# EAGLE design micromouse_board_revB_V0.0.12 (EAGLE 9.4.2)
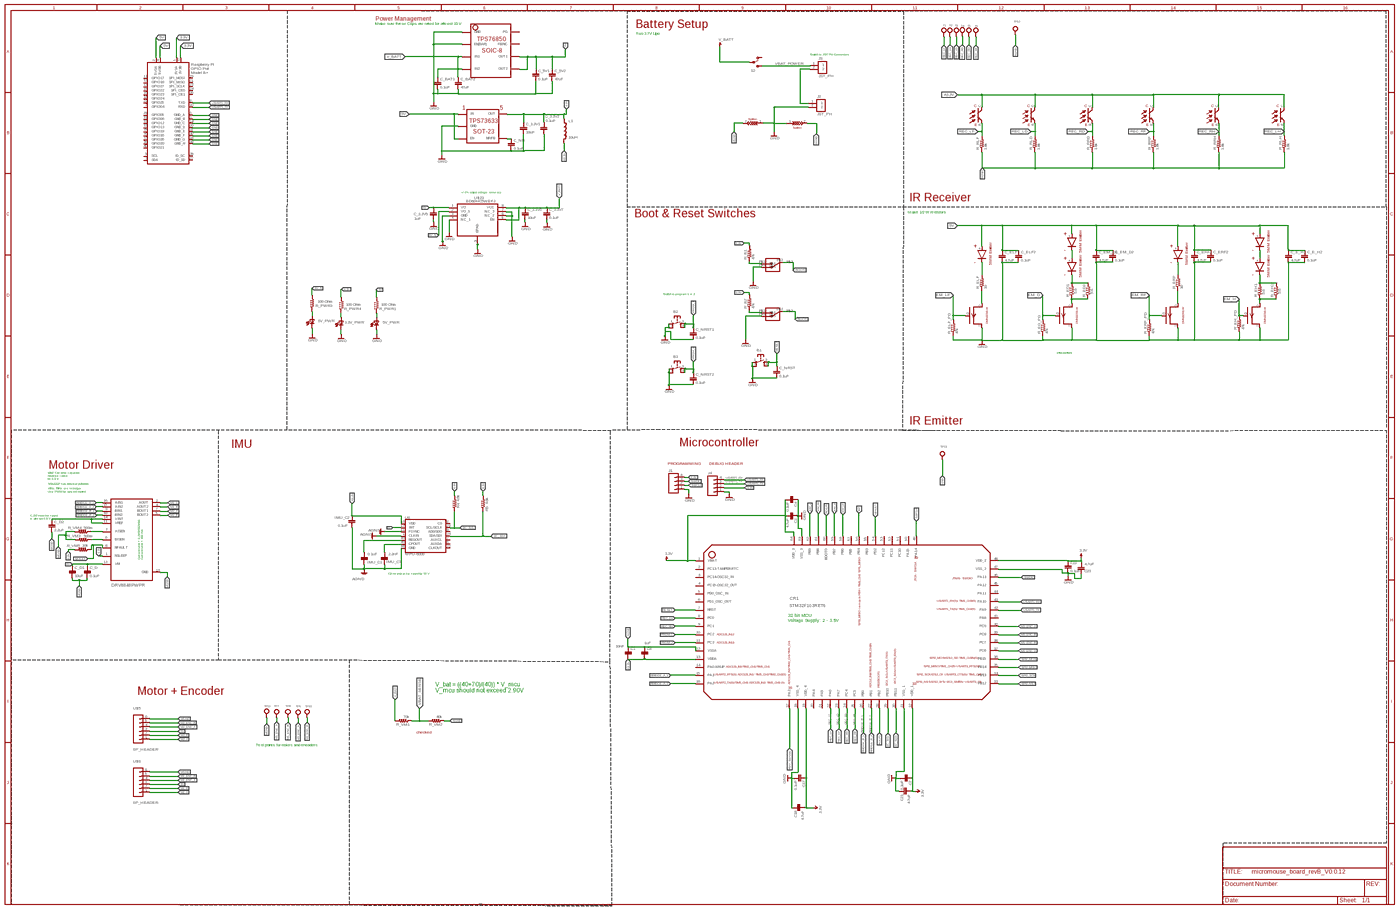
[diagram p0: schematic, sheet 1, overview]
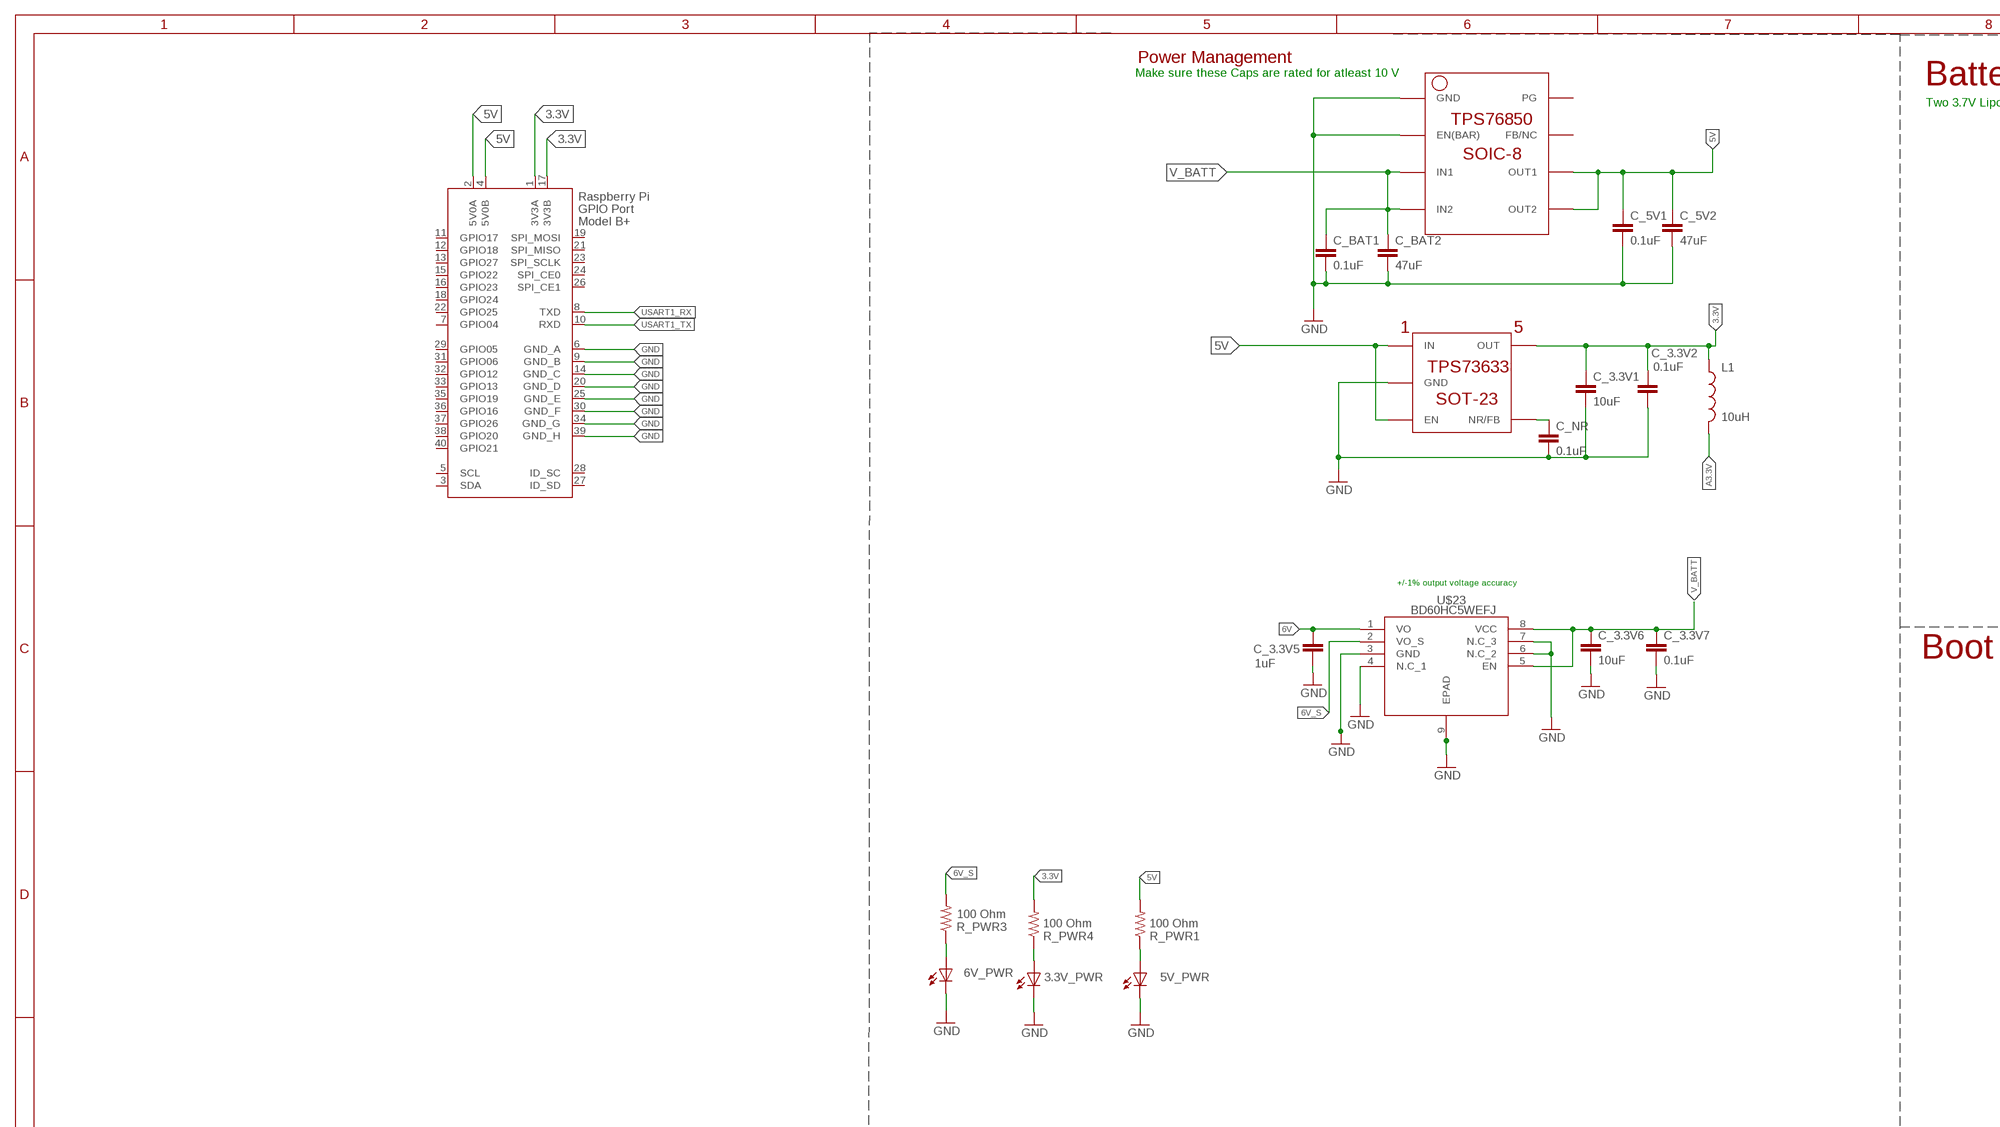
[diagram p1: schematic, sheet 1, part 1 of 4]
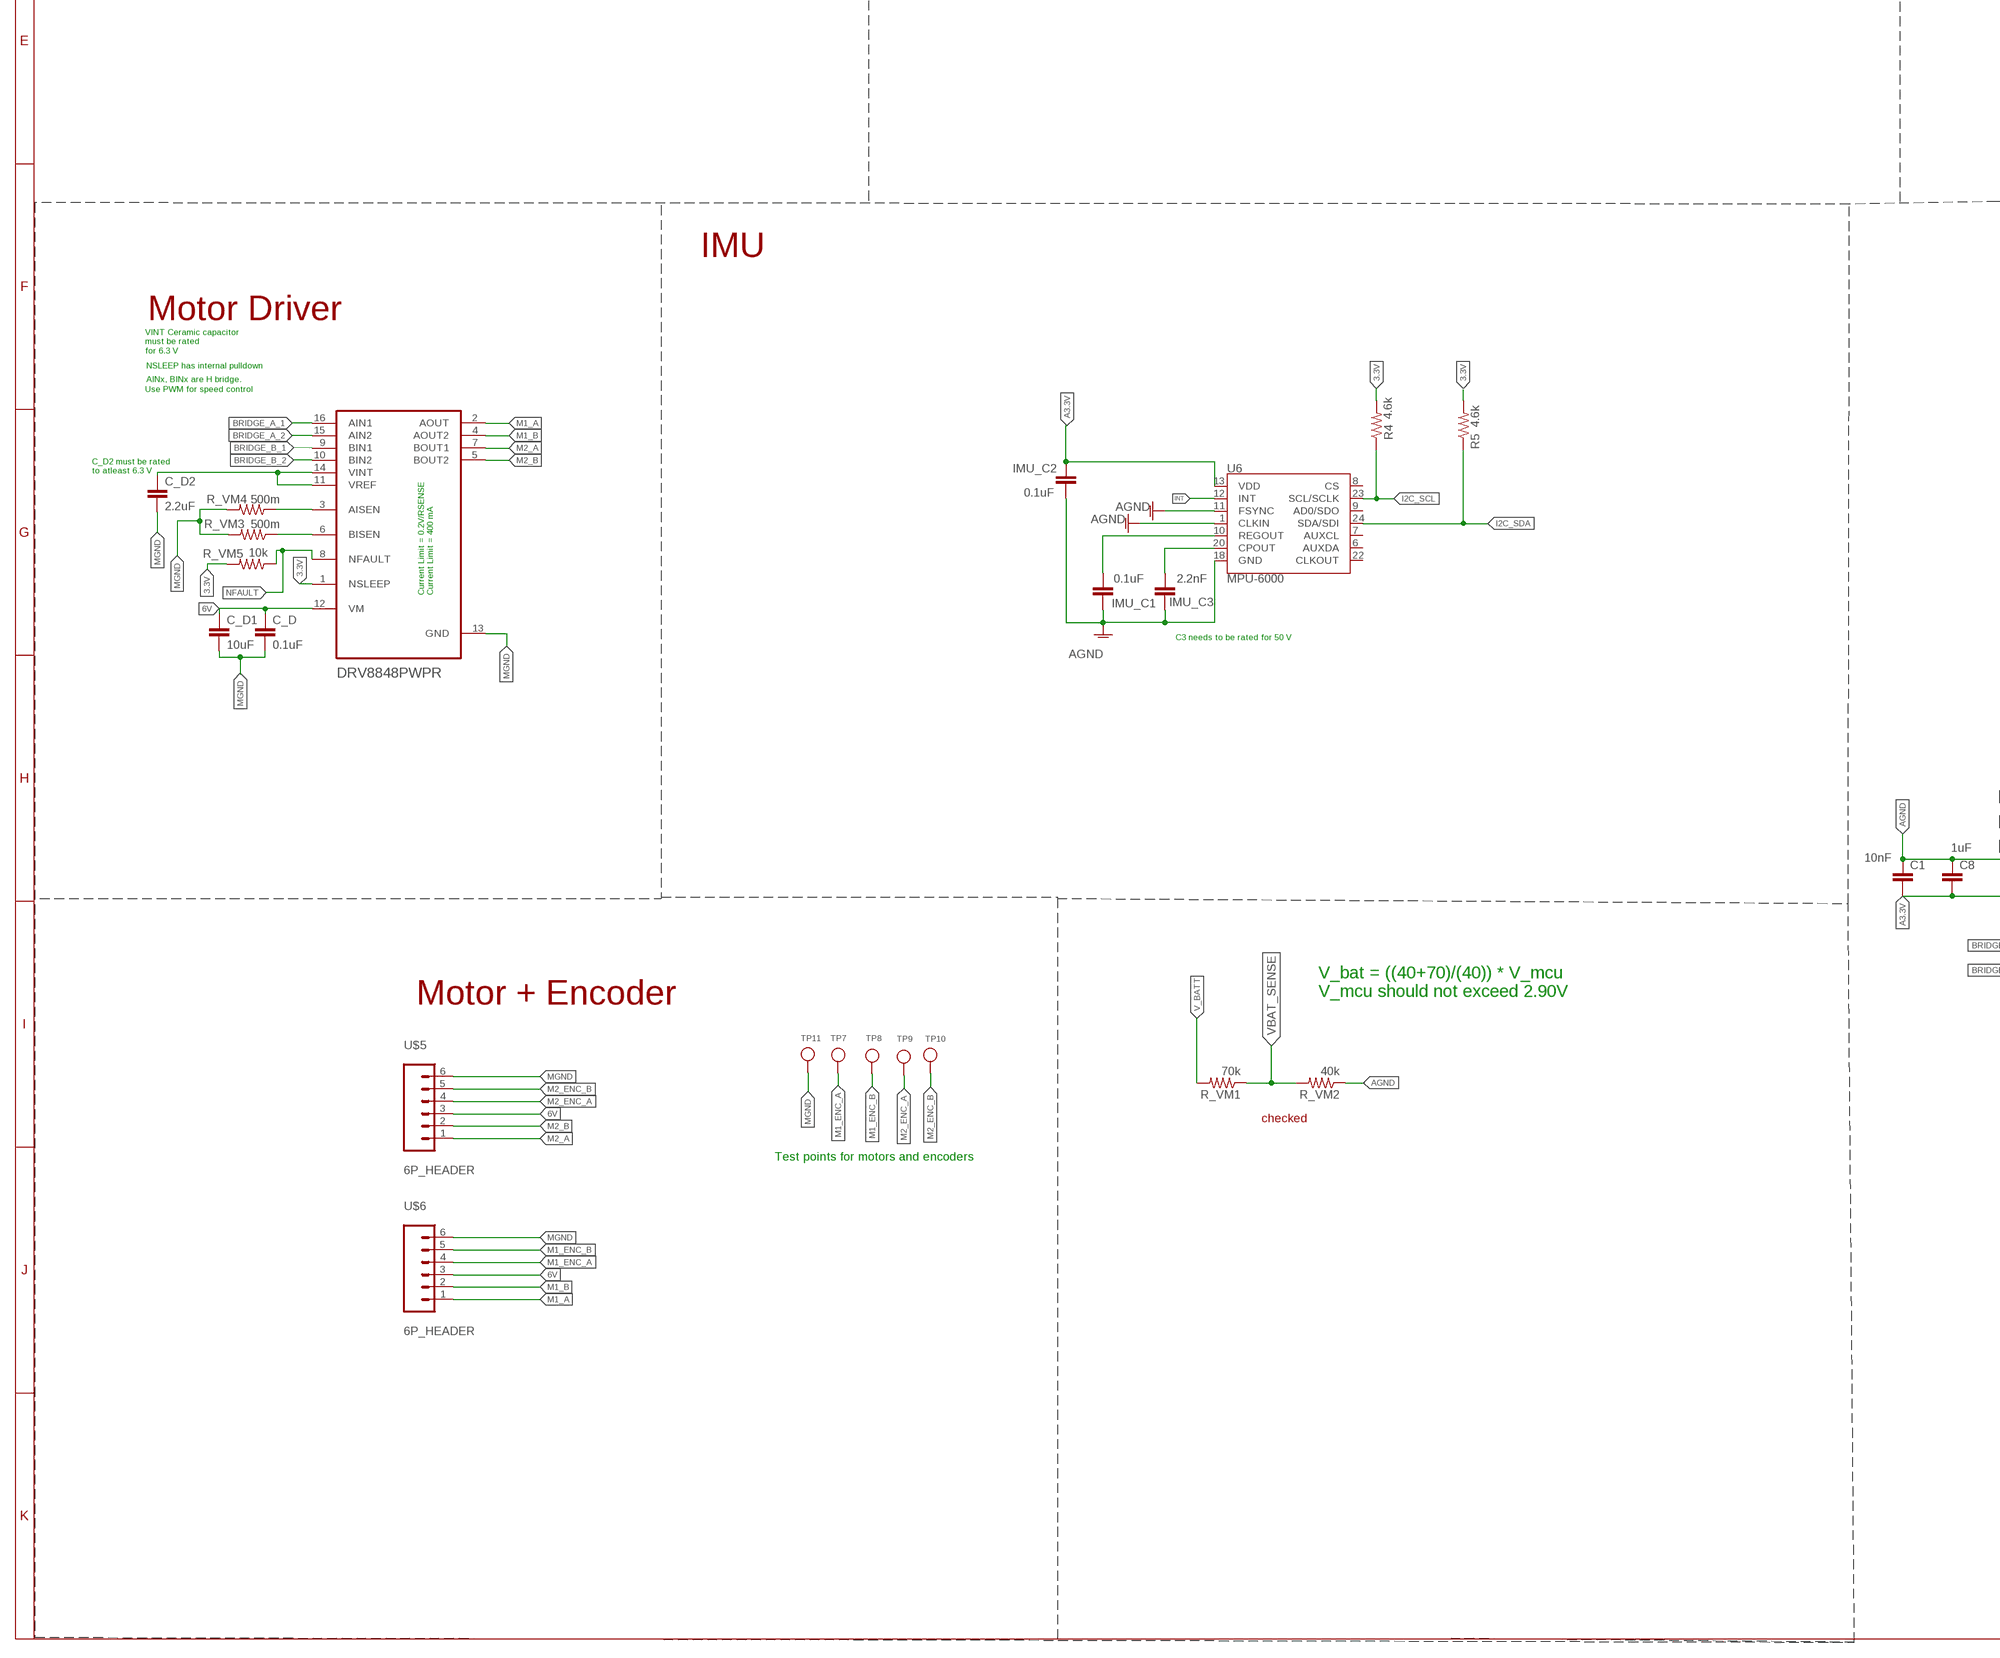
[diagram p2: schematic, sheet 1, part 2 of 4]
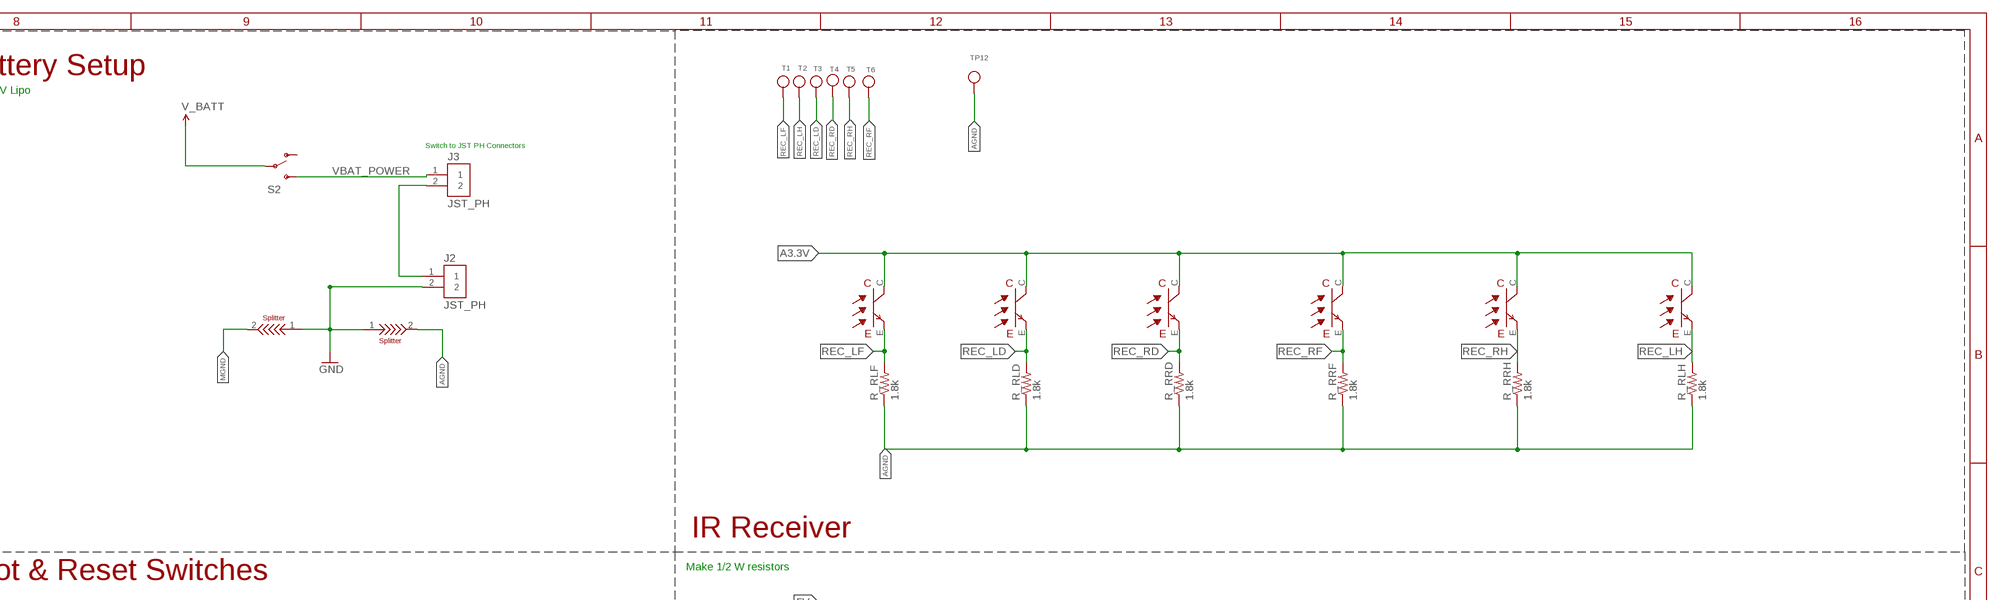
[diagram p3: schematic, sheet 1, part 3 of 4]
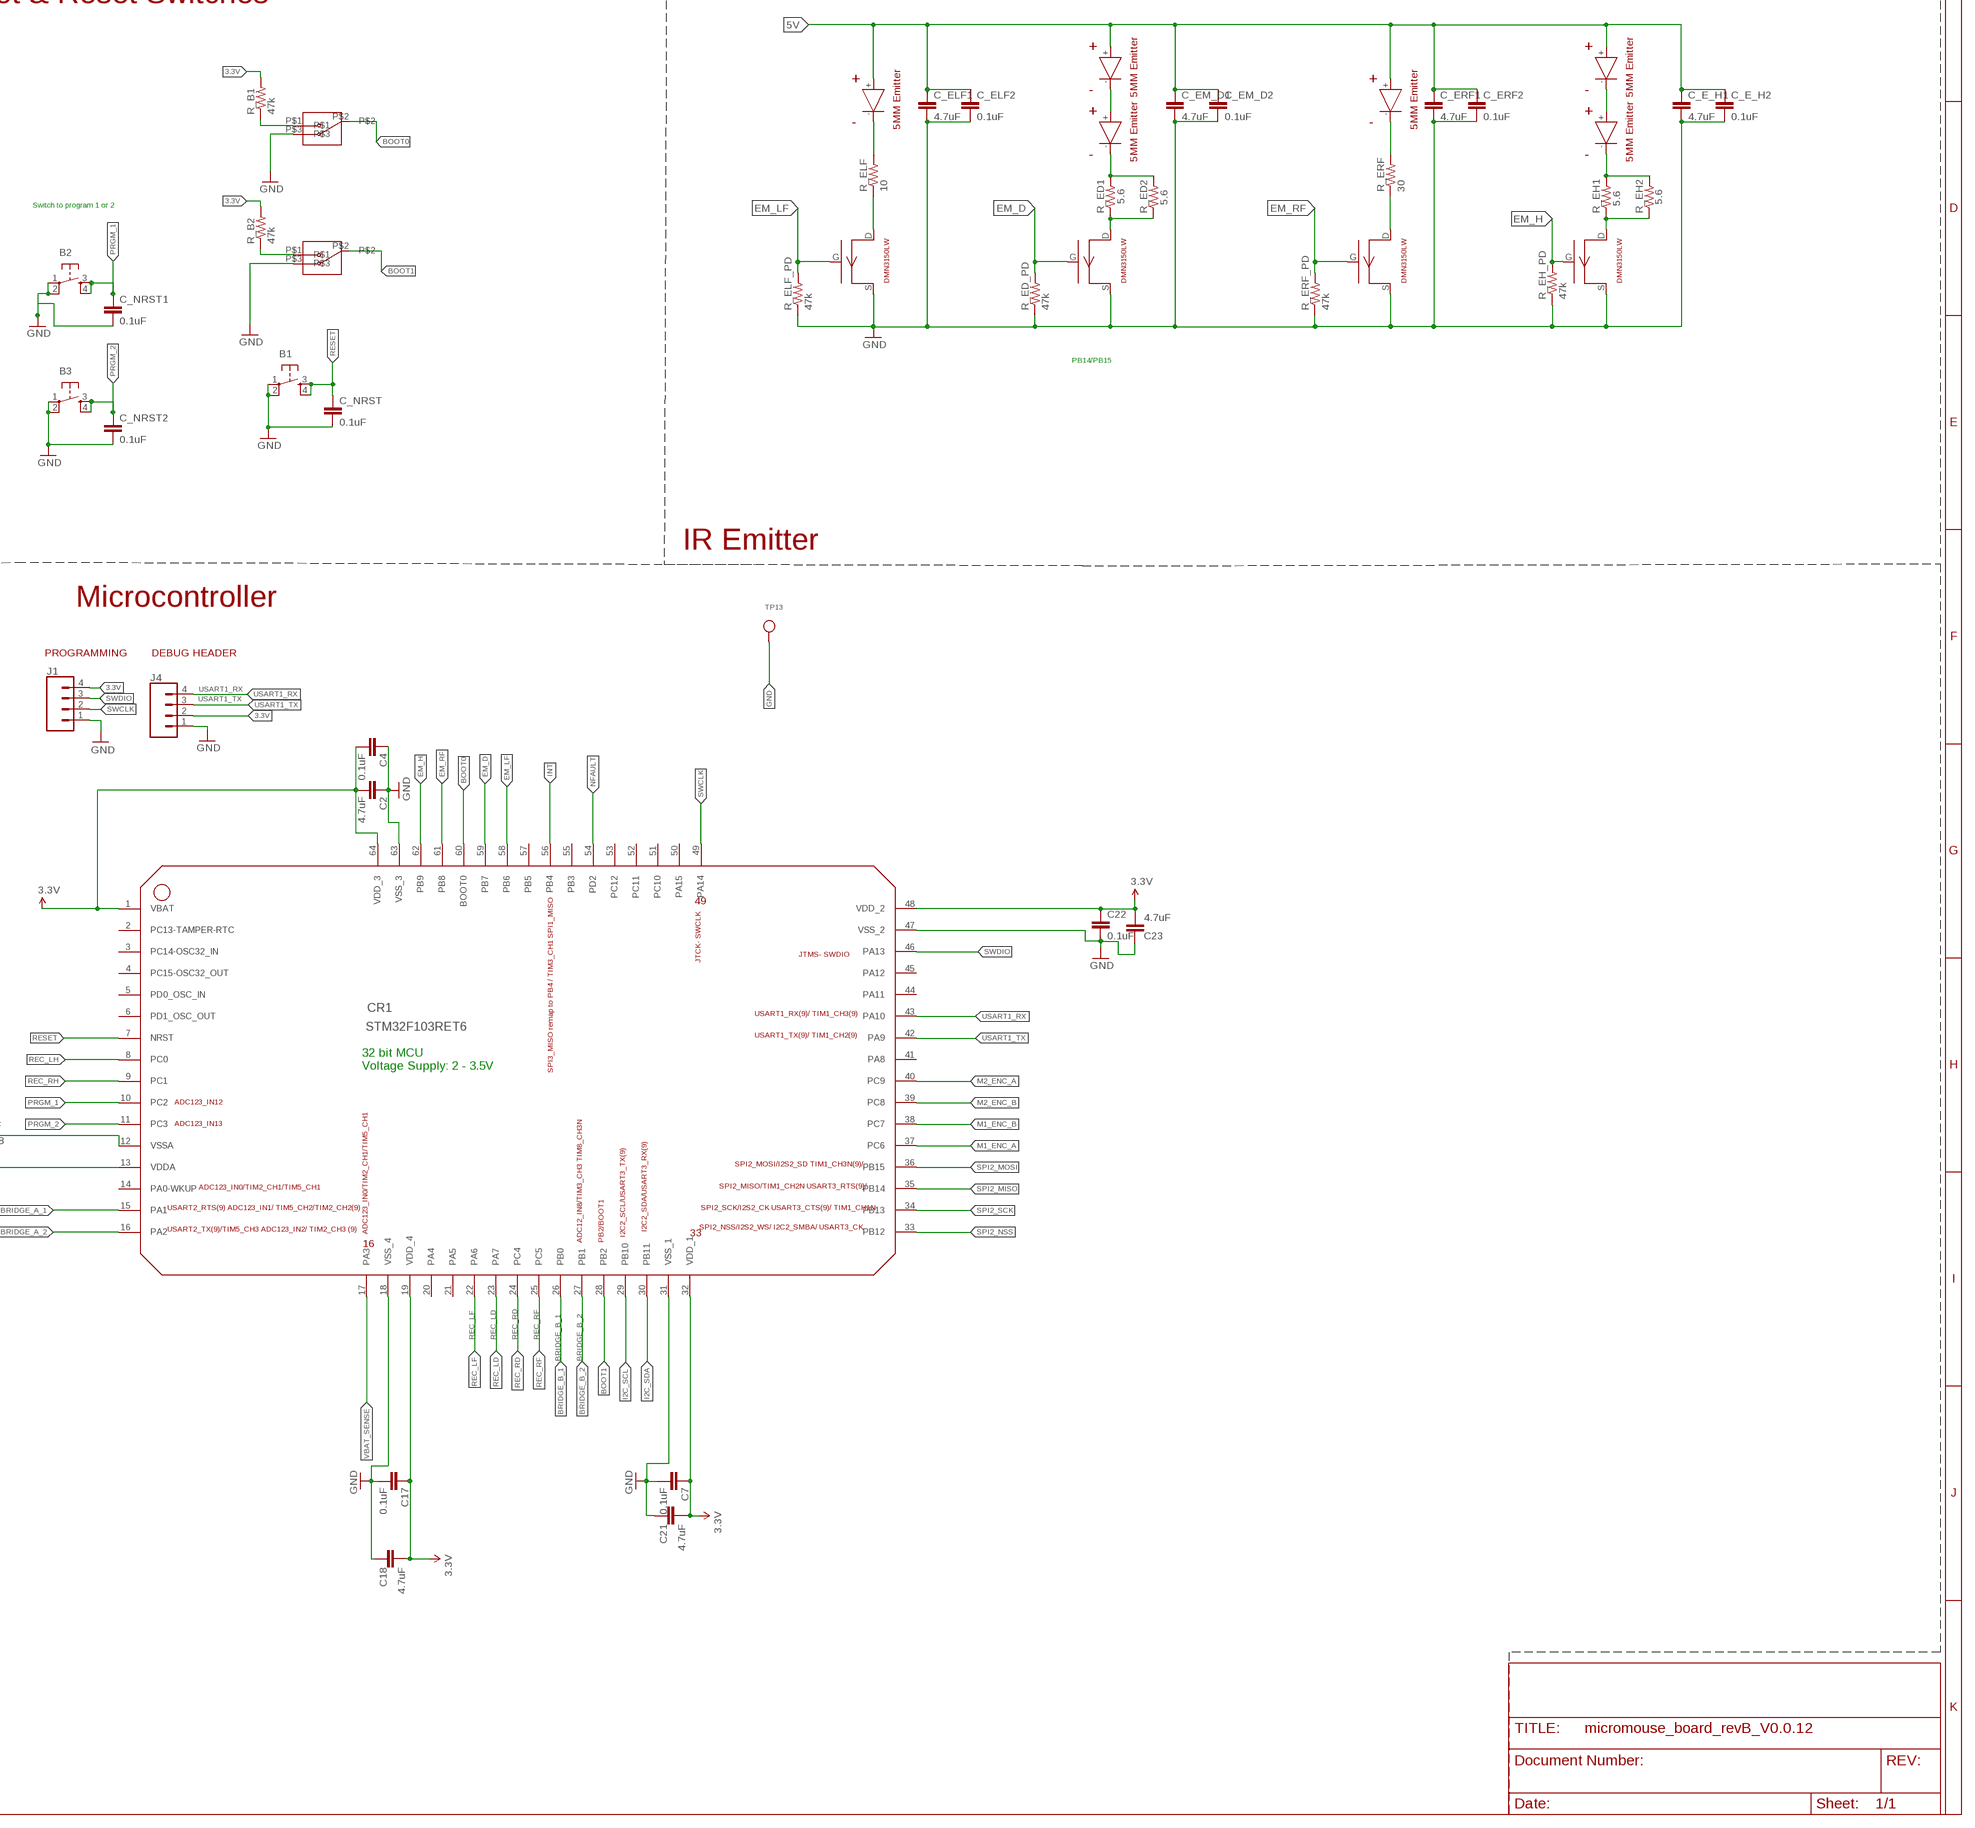
[diagram p4: schematic, sheet 1, part 4 of 4]

## Parts
3.3V_PWR  green  LED1206  [LED-1206]
5V_PWR  green  LED1206  [LED-1206]
6V_PWR  green  LED1206  [LED-1206]
B1  TAC_SWITCHSMD  [TACTILE-SWITCH-SMD]
B2  TAC_SWITCHSMD  [TACTILE-SWITCH-SMD]
B3  TAC_SWITCHSMD  [TACTILE-SWITCH-SMD]
C1  10nF  CAP0603-CAP  [0603-CAP]
C2  4.7uF  CAP0603-CAP  [0603-CAP]
C4  0.1uF  CAP0603-CAP  [0603-CAP]
C7  0.1uF  CAP0603-CAP  [0603-CAP]
C8  1uF  CAP0603-CAP  [0603-CAP]
C17  0.1uF  CAP0603-CAP  [0603-CAP]
C18  4.7uF  CAP0603-CAP  [0603-CAP]
C21  4.7uF  CAP0603-CAP  [0603-CAP]
C22  0.1uF  CAP0603-CAP  [0603-CAP]
C23  4.7uF  CAP0603-CAP  [0603-CAP]
C_3.3V1  10uF  CAP0603-CAP  [0603-CAP]
C_3.3V2  0.1uF  CAP0603-CAP  [0603-CAP]
C_3.3V5  1uF  CAP0603-CAP  [0603-CAP]
C_3.3V6  10uF  CAP0603-CAP  [0603-CAP]
C_3.3V7  0.1uF  CAP0603-CAP  [0603-CAP]
C_5V1  0.1uF  CAP0603-CAP  [0603-CAP]
C_5V2  47uF  CAP1210  [1210]
C_BAT1  0.1uF  CAP0603-CAP  [0603-CAP]
C_BAT2  47uF  CAP1210  [1210]
C_D  0.1uF  CAP0603-CAP  [0603-CAP]
C_D1  10uF  CAP0603-CAP  [0603-CAP]
C_D2  2.2uF  CAP0603-CAP  [0603-CAP]
C_E_H1  4.7uF  CAP0603-CAP  [0603-CAP]
C_E_H2  0.1uF  CAP0603-CAP  [0603-CAP]
C_ELF1  4.7uF  CAP0603-CAP  [0603-CAP]
C_ELF2  0.1uF  CAP0603-CAP  [0603-CAP]
C_EM_D1  4.7uF  CAP0603-CAP  [0603-CAP]
C_EM_D2  0.1uF  CAP0603-CAP  [0603-CAP]
C_ERF1  4.7uF  CAP0603-CAP  [0603-CAP]
C_ERF2  0.1uF  CAP0603-CAP  [0603-CAP]
C_NR  0.1uF  CAP0603-CAP  [0603-CAP]
C_NRST  0.1uF  CAP0603-CAP  [0603-CAP]
C_NRST1  0.1uF  CAP0603-CAP  [0603-CAP]
C_NRST2  0.1uF  CAP0603-CAP  [0603-CAP]
CR1  STM32F103RET6  [LQFP-64]
IMU_C1  0.1uF  CAP0603-CAP  [0603-CAP]
IMU_C2  0.1uF  CAP0603-CAP  [0603-CAP]
IMU_C3  2.2nF  CAP0603-CAP  [0603-CAP]
J1  CONN_04  [1X04]
J2  JST_PH  B2B-PH-K-S(LF)(SN)  [JST_B2B-PH-K-S(LF)(SN)]
J3  JST_PH  B2B-PH-K-S(LF)(SN)  [JST_B2B-PH-K-S(LF)(SN)]
J4  CONN_04  [1X04]
L1  10uH  INDUCTOR1007  [1007]
LEFT_FRONT_EMITTER  EMITTER  [EMITTER]
NMOS1  DMN3150LW  [DMN3150LW]
NMOS2  DMN3150LW  [DMN3150LW]
NMOS3  DMN3150LW  [DMN3150LW]
NMOS4  DMN3150LW  [DMN3150LW]
R4  4.6k  R-US_M0805  [M0805]
R5  4.6k  R-US_M0805  [M0805]
R_B1  47k  RESISTOR0603-RES  [0603-RES]
R_B2  47k  RESISTOR0603-RES  [0603-RES]
R_ED1  5.6  RESISTOR0603-RES  [0603-RES]
R_ED2  5.6  RESISTOR0603-RES  [0603-RES]
R_ED_PD  47k  RESISTOR0603-RES  [0603-RES]
R_EH1  5.6  RESISTOR0603-RES  [0603-RES]
R_EH2  5.6  RESISTOR0603-RES  [0603-RES]
R_EH_PD  47k  RESISTOR0603-RES  [0603-RES]
R_ELF  10  RESISTOR0603-RES  [0603-RES]
R_ELF_PD  47k  RESISTOR0603-RES  [0603-RES]
R_ERF  30  RESISTOR0603-RES  [0603-RES]
R_ERF_PD  47k  RESISTOR0603-RES  [0603-RES]
R_PWR1  100 Ohm  RESISTOR0603-RES  [0603-RES]
R_PWR3  100 Ohm  RESISTOR0603-RES  [0603-RES]
R_PWR4  100 Ohm  RESISTOR0603-RES  [0603-RES]
R_RLD  1.8k  RESISTOR0603-RES  [0603-RES]
R_RLF  1.8k  RESISTOR0603-RES  [0603-RES]
R_RLH  1.8k  RESISTOR0603-RES  [0603-RES]
R_RRD  1.8k  RESISTOR0603-RES  [0603-RES]
R_RRF  1.8k  RESISTOR0603-RES  [0603-RES]
R_RRH  1.8k  RESISTOR0603-RES  [0603-RES]
R_VM1  70k  RESISTOR0603-RES  [0603-RES]
R_VM2  40k  RESISTOR0603-RES  [0603-RES]
R_VM3  500m  RESISTOR0603-RES  [0603-RES]
R_VM4  500m  RESISTOR0603-RES  [0603-RES]
R_VM5  10k  RESISTOR0603-RES  [0603-RES]
REC_LF  RECEIVER  [RECEIVER]
S2  SWITCH-SPSTPTH  [SWITCH-SPDT]
T1  TESTPOINTROUND2MM  [TESTPOINT_ROUND_2MM]
T2  TESTPOINTROUND2MM  [TESTPOINT_ROUND_2MM]
T3  TESTPOINTROUND2MM  [TESTPOINT_ROUND_2MM]
T4  TESTPOINTROUND2MM  [TESTPOINT_ROUND_2MM]
T5  TESTPOINTROUND2MM  [TESTPOINT_ROUND_2MM]
T6  TESTPOINTROUND2MM  [TESTPOINT_ROUND_2MM]
TP7  TESTPOINTROUND2MM  [TESTPOINT_ROUND_2MM]
TP8  TESTPOINTROUND2MM  [TESTPOINT_ROUND_2MM]
TP9  TESTPOINTROUND2MM  [TESTPOINT_ROUND_2MM]
TP10  TESTPOINTROUND2MM  [TESTPOINT_ROUND_2MM]
TP11  TESTPOINTROUND2MM  [TESTPOINT_ROUND_2MM]
TP12  TESTPOINTROUND2MM  [TESTPOINT_ROUND_2MM]
TP13  TESTPOINTROUND2MM  [TESTPOINT_ROUND_2MM]
U2  DRV8848PWPR  [SOP65P640X120-17N]
U6  MPU-6000  [QFN-24-EP]
U$3  TPS73633(SOT-23)  [TPS73633(SOT-23)]
U$4  TPS76850(SOIC-8)  [TPS76850(SOIC-8)]
U$5  6P_HEADER  [6P_HEADER]
U$6  6P_HEADER  [6P_HEADER]
U$7  RECEIVER  [RECEIVER]
U$8  RECEIVER  [RECEIVER]
U$9  RECEIVER  [RECEIVER]
U$11  EMITTER  [EMITTER]
U$13  EMITTER  [EMITTER]
U$14  SPARKFUN-SPDT  [SPDT]
U$15  SPARKFUN-SPDT  [SPDT]
U$16  SPLITTER  [SPLITTER]
U$17  EMITTER  [EMITTER]
U$18  EMITTER  [EMITTER]
U$19  EMITTER  [EMITTER]
U$20  RECEIVER  [RECEIVER]
U$21  RECEIVER  [RECEIVER]
U$22  SPLITTER  [SPLITTER]
U$23  BD60HC5WEFJ  [SOIC127P600X100-9N]
X1  RASPI_GPIO_B+#_PIN  [RASPI_GPIO_B+_PIN]

## Nets
3.3V [3.3V]: C2.2 C4.2 C7.1 C17.1 C18.2 C21.2 C22.1 C23.2 C_3.3V1.1 C_3.3V2.1 CR1.1(VBAT) CR1.19(VDD_4) CR1.32(VDD_1) CR1.48(VDD_2) CR1.64(VDD_3) J1.4 J4.2 L1.1 R4.2 R5.2 R_B1.2 R_B2.2 R_PWR4.2 R_VM5.2 U2.1(NSLEEP) U$3.OUT X1.1(3V3A) X1.17(3V3B)
5V [5V]: C_5V1.1 C_5V2.1 C_E_H1.1 C_E_H2.1 C_ELF1.1 C_ELF2.1 C_EM_D1.1 C_EM_D2.1 C_ERF1.1 C_ERF2.1 LEFT_FRONT_EMITTER.+ R_PWR1.2 U$3.EN U$3.IN U$4.OUT1 U$4.OUT2 U$11.+ U$13.+ U$18.+ X1.2(5V0A) X1.4(5V0B)
6V [6V]: C_3.3V5.1 C_D1.1 C_D.1 U2.12(VM) U$5.3 U$6.3 U$23.1(VO)
6V_S [6V_S]: R_PWR3.2 U$23.2(VO_S)
A3.3V: C1.2 C8.2 CR1.13(VDDA) IMU_C2.1 L1.2 REC_LF.C U6.13(VDD) U$7.C U$8.C U$9.C U$20.C U$21.C
AGND [AGND]: C1.1 C8.1 CR1.12(VSSA) IMU_C1.2 IMU_C2.2 IMU_C3.2 R_RLD.1 R_RLF.1 R_RLH.1 R_RRD.1 R_RRF.1 R_RRH.1 R_VM2.1 TP12.P$1 U6.1(CLKIN) U6.11(FSYNC) U6.18(GND) U$22.2
BOOT0: CR1.60(BOOT0) U$14.P$2
BOOT1: CR1.28(PB2) U$15.P$2
BRIDGE_A_1: CR1.15(PA1) U2.16(AIN1)
BRIDGE_A_2: CR1.16(PA2) U2.15(AIN2)
BRIDGE_B_1: CR1.26(PB0) U2.9(BIN1)
BRIDGE_B_2: CR1.27(PB1) U2.10(BIN2)
D2_EM: R_ED1.2 R_ED2.2 U$17.-
D_EM: U$11.- U$17.+
EM_D: CR1.59(PB7) NMOS2.G R_ED_PD.2
EM_H: CR1.62(PB9) NMOS4.G R_EH_PD.2
EM_LF: CR1.58(PB6) NMOS1.G R_ELF_PD.2
EM_RF: CR1.61(PB8) NMOS3.G R_ERF_PD.2
GND [GND]: 3.3V_PWR.C 5V_PWR.C 6V_PWR.C B1.1 B1.2 B2.1 B2.2 B3.1 B3.2 C2.1 C4.1 C7.2 C17.2 C18.1 C21.1 C22.2 C23.1 C_3.3V1.2 C_3.3V2.2 C_3.3V5.2 C_3.3V6.2 C_3.3V7.2 C_5V1.2 C_5V2.2 C_BAT1.2 C_BAT2.2 C_E_H1.2 C_E_H2.2 C_ELF1.2 C_ELF2.2 C_EM_D1.2 C_EM_D2.2 C_ERF1.2 C_ERF2.2 C_NR.2 C_NRST1.2 C_NRST2.2 C_NRST.2 CR1.18(VSS_4) CR1.31(VSS_1) CR1.47(VSS_2) CR1.63(VSS_3) J1.1 J2.2 J4.1 NMOS1.S NMOS2.S NMOS3.S NMOS4.S R_ED_PD.1 R_EH_PD.1 R_ELF_PD.1 R_ERF_PD.1 TP13.P$1 U$3.GND U$4.EN(BAR) U$4.GND U$14.P$3 U$15.P$3 U$16.1 U$22.1 U$23.3(GND) U$23.4(N.C_1) U$23.6(N.C_2) U$23.7(N.C_3) U$23.9(EPAD) X1.6(GND_A) X1.9(GND_B) X1.14(GND_C) X1.20(GND_D) X1.25(GND_E) X1.30(GND_F) X1.34(GND_G) X1.39(GND_H)
H2_EM: R_EH1.2 R_EH2.2 U$19.-
H_EM: U$18.- U$19.+
I2C_SCL: CR1.29(PB10) R4.1 U6.23(SCL/SCLK)
I2C_SDA: CR1.30(PB11) R5.1 U6.24(SDA/SDI)
INT: CR1.56(PB4) U6.12(INT)
LF_EM: LEFT_FRONT_EMITTER.- R_ELF.2
M1_A [M1]: U2.2(AOUT) U$6.1
M1_B [M1]: U2.4(AOUT2) U$6.2
M1_ENC_A: CR1.37(PC6) TP7.P$1 U$6.4
M1_ENC_B: CR1.38(PC7) TP8.P$1 U$6.5
M2_A [M2]: U2.7(BOUT1) U$5.1
M2_B [M2]: U2.5(BOUT2) U$5.2
M2_ENC_A: CR1.40(PC9) TP9.P$1 U$5.4
M2_ENC_B: CR1.39(PC8) TP10.P$1 U$5.5
MGND [MGND]: C_D1.2 C_D2.2 C_D.2 R_VM3.2 R_VM4.2 TP11.P$1 U2.13(GND) U$5.6 U$6.6 U$16.2
N$1: 3.3V_PWR.A R_PWR4.1
N$2: R_VM4.1 U2.3(AISEN)
N$3: J2.1 J3.2
N$4: R_B2.1 U$15.P$1
N$5: NMOS3.D R_ERF.1
N$6: R_B1.1 U$14.P$1
N$7: NMOS1.D R_ELF.1
N$8: R_VM3.1 U2.6(BISEN)
N$9: 6V_PWR.A R_PWR3.1
N$11: C_D2.1 U2.11(VREF) U2.14(VINT)
N$14: 5V_PWR.A R_PWR1.1
N$18: NMOS2.D R_ED1.1 R_ED2.1
N$19: NMOS4.D R_EH1.1 R_EH2.1
N$26: C_NR.1 U$3.NR/FB
N$28: IMU_C1.1 U6.10(REGOUT)
N$29: IMU_C3.1 U6.20(CPOUT)
NFAULT: CR1.54(PD2) R_VM5.1 U2.8(NFAULT)
PRGM_1: B2.3 B2.4 C_NRST1.1 CR1.10(PC2)
PRGM_2: B3.3 B3.4 C_NRST2.1 CR1.11(PC3)
REC_LD: CR1.23(PA7) R_RLD.2 T3.P$1 U$7.E
REC_LF: CR1.22(PA6) R_RLF.2 REC_LF.E T1.P$1
REC_LH: CR1.8(PC0) R_RLH.2 T2.P$1 U$21.E
REC_RD: CR1.24(PC4) R_RRD.2 T4.P$1 U$8.E
REC_RF: CR1.25(PC5) R_RRF.2 T6.P$1 U$9.E
REC_RH: CR1.9(PC1) R_RRH.2 T5.P$1 U$20.E
RESET: B1.3 B1.4 C_NRST.1 CR1.7(NRST)
RF_EM: R_ERF.2 U$13.-
SPI2_MISO: CR1.35(PB14)
SPI2_MOSI: CR1.36(PB15)
SPI2_NSS: CR1.33(PB12)
SPI2_SCK: CR1.34(PB13)
SWCLK: CR1.49(PA14) J1.2
SWDIO: CR1.46(PA13) J1.3
USART1_RX: CR1.43(PA10) J4.4 X1.8(TXD)
USART1_TX: CR1.42(PA9) J4.3 X1.10(RXD)
V_BATT [V_BATT]: C_3.3V6.1 C_3.3V7.1 C_BAT1.1 C_BAT2.1 R_VM1.2 S2.2(P) U$4.IN1 U$4.IN2 U$23.5(EN) U$23.8(VCC)
VBAT_POWER [V_BATT]: J3.1 S2.3(S)
VBAT_SENSE: CR1.17(PA3) R_VM1.1 R_VM2.2
Unconnected: CR1.2(PC13-TAMPER-RTC) CR1.3(PC14-OSC32_IN) CR1.4(PC15-OSC32_OUT) CR1.5(PD0_OSC_IN) CR1.6(PD1_OSC_OUT) CR1.14(PA0-WKUP) CR1.20(PA4) CR1.21(PA5) CR1.41(PA8) CR1.44(PA11) CR1.45(PA12) CR1.50(PA15) CR1.51(PC10) CR1.52(PC11) CR1.53(PC12) CR1.55(PB3) CR1.57(PB5) S2.1(O) U6.6(AUXDA) U6.7(AUXCL) U6.8(CS) U6.9(AD0/SDO) U6.22(CLKOUT) U$4.FB/NC U$4.PG X1.3(SDA) X1.5(SCL) X1.7(GPIO04) X1.11(GPIO17) X1.12(GPIO18) X1.13(GPIO27) X1.15(GPIO22) X1.16(GPIO23) X1.18(GPIO24) X1.19(SPI_MOSI) X1.21(SPI_MISO) X1.22(GPIO25) X1.23(SPI_SCLK) X1.24(SPI_CE0) X1.26(SPI_CE1) X1.27(ID_SD) X1.28(ID_SC) X1.29(GPIO05) X1.31(GPIO06) X1.32(GPIO12) X1.33(GPIO13) X1.35(GPIO19) X1.36(GPIO16) X1.37(GPIO26) X1.38(GPIO20) X1.40(GPIO21)

## Notes on the sheet
- Power Management
- Make sure these Caps are rated for atleast 10 V
- Battery Setup
- Two 3.7V Lipo
- Switch to JST PH Connectors
- +/-1% output voltage accuracy
- IR Receiver
- Make 1/2 W resistors
- Boot & Reset Switches
- Switch to program 1 or 2
- PB14/PB15
- IR Emitter
- IMU | Microcontroller
- PROGRAMMING        DEBUG HEADER
- Motor Driver
- VINT Ceramic capacitor 
  must be rated 
  for 6.3 V
- NSLEEP has internal pulldown
- AINx, BINx are H bridge.
- Use PWM for speed control
- C_D2 must be rated
  to atleast 6.3 V
- SPI3_MISO remap to PB4 / TIM3_CH1 SPI1_MISO
- Current Limit = 0.2V/RSENSE
  Current Limit = 400 mA
- C3 needs to be rated for 50 V
- JTMS- SWDIO
- JTCK- SWCLK
- USART1_RX(9)/ TIM1_CH3(9)
- USART1_TX(9)/ TIM1_CH2(9)
- 32 bit MCU
  Voltage Supply: 2 - 3.5V
- ADC123_IN12
- ADC123_IN13
- SPI2_MOSI/I2S2_SD TIM1_CH3N(9)/
- ADC123_IN0/TIM2_CH1/TIM5_CH1 | SPI2_MISO/TIM1_CH2N USART3_RTS(9)/
- USART2_RTS(9) ADC123_IN1/ TIM5_CH2/TIM2_CH2(9) | SPI2_SCK/I2S2_CK USART3_CTS(9)/ TIM1_CH1N
- SPI2_NSS/I2S2_WS/ I2C2_SMBA/ USART3_CK
- USART2_TX(9)/TIM5_CH3 ADC123_IN2/ TIM2_CH3 (9) | ADC123_IN0/TIM2_CH1/TIM5_CH1 | I2C2_SDA/USART3_RX(9)
- I2C2_SCL/USART3_TX(9)
- ADC12_IN8/TIM3_CH3 TIM8_CH3N | PB2/BOOT1
- V_bat = ((40+70)/(40)) * V_mcu
  V_mcu should not exceed 2.90V
- Motor + Encoder
- checked
- Test points for motors and encoders

## Library data of the parts
3.3V_PWR 5V_PWR 6V_PWR = micromouse-board-added-piconnector:LED: LEDs Standard schematic elements and footprints for 5mm, 3mm, 1206, and 0603 sized LEDs. 5mm - Spark Fun Electronics SKU : COM-00529 (and others)
B1-B3 = SparkFun-Retired:TAC_SWITCH: Momentary Switch Button commonly used for reset or general input. Spark Fun Electronics SKU : COM-00097 SMT- SWCH-08247; PROD_ID: SWCH-08247; VALUE: TAC_SWITCHSMD
C1 C2 C4 C7 C8 C17 C18 C21-C23 C_3.3V1 C_3.3V2 C_3.3V5-C_3.3V7 C_5V1 C_5V2 C_BAT1 C_BAT2 C_D C_D1 C_D2 C_E_H1 C_E_H2 C_ELF1 C_ELF2 C_EM_D1 C_EM_D2 C_ERF1 C_ERF2 C_NR IMU_C1-IMU_C3 = micromouse-board-added-piconnector:CAP: Capacitor Standard 0603 ceramic capacitor, and 0.1" leaded capacitor.
C_NRST C_NRST1 C_NRST2 = SparkFun:CAP: Capacitor Standard 0603 ceramic capacitor, and 0.1" leaded capacitor.
CR1 = micromouse-board-added-piconnector:STM32F103RET6; MANUFACTURER_PART_NUMBER: STM32F103RET6; VENDOR: STMicroelectronics
J1 J4 = micromouse-board-added-piconnector:CONN_04: Multi connection point. Often used as Generic Header-pin footprint for 0.1 inch spaced/style header connections On any of the 0.1 inch spaced packages, you can populate with these: Break Away Headers - Straight <https://www.sparkfun.com/products/116> (PRT-00116) Break Away Male Headers - Right Angle <https://www.sparkfun.com/products/553> (PRT-00553) Female Headers <https://www.sparkfun.com/products/115> (PRT-00115) Break Away Headers - Machine Pin <https://www.sparkfun.com/products/117> (PRT-00117) Break Away Female Headers - Swiss Machine Pin <https://www.sparkfun.com/products/743> (PRT-00743) For SCREWTERMINALS and SPRING TERMINALS visit here: Screw Terimnals on SparkFun.com <https://www.sparkfun.com/search/results?term=Screw+Terminals> (5mm/3.5mm/2.54mm spacing) This device is also useful as a general connection point to wire up your design to another part of your project. Our various solder wires solder well into these plated through hole pads. Hook-Up Wire - Assortment (Stranded, 22 AWG) <https://www.sparkfun.com/products/11375> (PRT-11375) Hook-Up Wire - Assortment (Solid Core, 22 AWG) <https://www.sparkfun.com/products/11367> (PRT-11367) View the entire wire category on our website here <https://www.sparkfun.com/categories/141> Special notes: Molex polarized connector foot print use with SKU : PRT-08231 with associated crimp pins and housings. 1MM SMD Version SKU: PRT-10208; PROD_ID: CONN-09696
J2 J3 = B2B-PH-K-S_LF__SN_:B2B-PH-K-S(LF)(SN): PH Series 2 Position 2 mm Pitch Through Hole Top Entry Shrouded Header; DESCRIPTION: Connector Header Through Hole 2 position 0.079 _2.00mm_; MF: JST Sales; MP: B2B-PH-K-S_LF__SN_; PACKAGE: None
L1 = SparkFun-Passives:INDUCTOR: Inductors Basic Inductor/Choke - 0603 and 1206. Footprints are not proven and vary greatly between part numbers. INDUCTOR POWER 3.3UH 4.0A SMD 0.197" L x 0.197" W x 0.177" H (5.00mm x 5.00mm x 4.50mm)
LEFT_FRONT_EMITTER U$11 U$13 U$17-U$19 = micromouse-board-added-piconnector:EMITTER
NMOS1-NMOS4 = micromouse-board-added-piconnector:DMN3150LW
R4 R5 = rcl:R-US_: RESISTOR, American symbol; SPICEPREFIX: R
R_B1 R_B2 = SparkFun-Passives:RESISTOR: Resistor Basic schematic elements and footprints for 0603, 1206, and PTH resistors.
R_ED1 R_ED2 R_ED_PD R_EH1 R_EH2 R_EH_PD R_ELF R_ELF_PD R_ERF R_ERF_PD R_PWR1 R_PWR3 R_PWR4 R_RLD R_RLF R_RLH R_RRD R_RRF R_RRH R_VM1-R_VM5 = micromouse-board-added-piconnector:RESISTOR: Resistor Basic schematic elements and footprints for 0603, 1206, and PTH resistors.
REC_LF U$7-U$9 U$20 U$21 = micromouse-board-added-piconnector:RECEIVER
S2 = micromouse-board-added-piconnector:SWITCH-SPST: SPST Switch Simple slide switch. Spark Fun Electronics SKU : COM-00102
T1-T6 TP7-TP13 = micromouse-board-added-piconnector:TESTPOINT: Test Point Various test points for characterisation and PCB testing TESTPOINT_SMT - Compact Surface Mount Test Point [Digikey: 5016KTR-ND]
U2 = micromouse-board-added-piconnector:DRV8848PWPR: None; AVAILABILITY: Unavailable; DESCRIPTION: 2A Dual H-Bridge Motor Driver _PWM Control_ 16-HTSSOP -40 to 85; MF: Texas Instruments; MP: DRV8848PWPR; PACKAGE: HTSSOP-16 Texas Instruments; PRICE: None
U6 = micromouse-board-added-piconnector:MPU-6000: Invensense MPU-6000 6-Axis Gryoscope/Accelerometer 3-axis gyroscope, 3-axis accelerometer in a 4x4 package. The MPU-6000 is the world’s first 6-axis I²C MotionTracking device designed for the low power, low cost, and high performance requirements of smartphones, tablets and wearable sensors. Datasheet <http://cdn.sparkfun.com/datasheets/Components/General%20IC/PS-MPU-6000A.pdf> SparkFun Products MPU-6000 - Motion Processing Unit <https://www.sparkfun.com/products/11234> (SEN-11234) SparkFun UDB5 - PIC UAV Development Board <https://www.sparkfun.com/products/11703> (GPS-11703); PROD_ID: IC-11089; SF_ID: SEN-11234
U$3 = micromouse-board-added-piconnector:TPS73633(SOT-23)
U$4 = micromouse-board-added-piconnector:TPS76850(SOIC-8)
U$5 U$6 = micro-motor:6P_HEADER: Generic 6P header
U$14 U$15 = micro-motor:SPARKFUN-SPDT
U$16 U$22 = splitter:SPLITTER
U$23 = BD33FC0WEFJ-E2:BD60HC5WEFJ
X1 = raspberrypi_bastelstube_v13:RASPI_GPIO_B+#: 2x20 header connector, all pins connected

## Net classes
0 default: width 0.254 mm, drill 0.254 mm, clearance 0.203 mm
1 5V: width 0.508 mm, drill 0.254 mm, clearance 0.254 mm
2 6V: width 0.305 mm, drill 0.305 mm, clearance 0.203 mm
3 6V_S: width 0.229 mm, drill 0.203 mm, clearance 0.203 mm
4 V_BATT: width 0.762 mm, drill 0.508 mm, clearance 0.254 mm
5 3.3V: width 0.254 mm, drill 0.254 mm, clearance 0.203 mm
6 MGND: width 0.305 mm, drill 0.305 mm, clearance 0.254 mm
7 AGND: width 0.254 mm, drill 0.203 mm, clearance 0.203 mm
8 GND: width 0.254 mm, drill 0.203 mm, clearance 0.203 mm
9 M1: width 0.254 mm, drill 0.254 mm, clearance 0.203 mm
10 M2: width 0.254 mm, drill 0.254 mm, clearance 0.203 mm

## Board
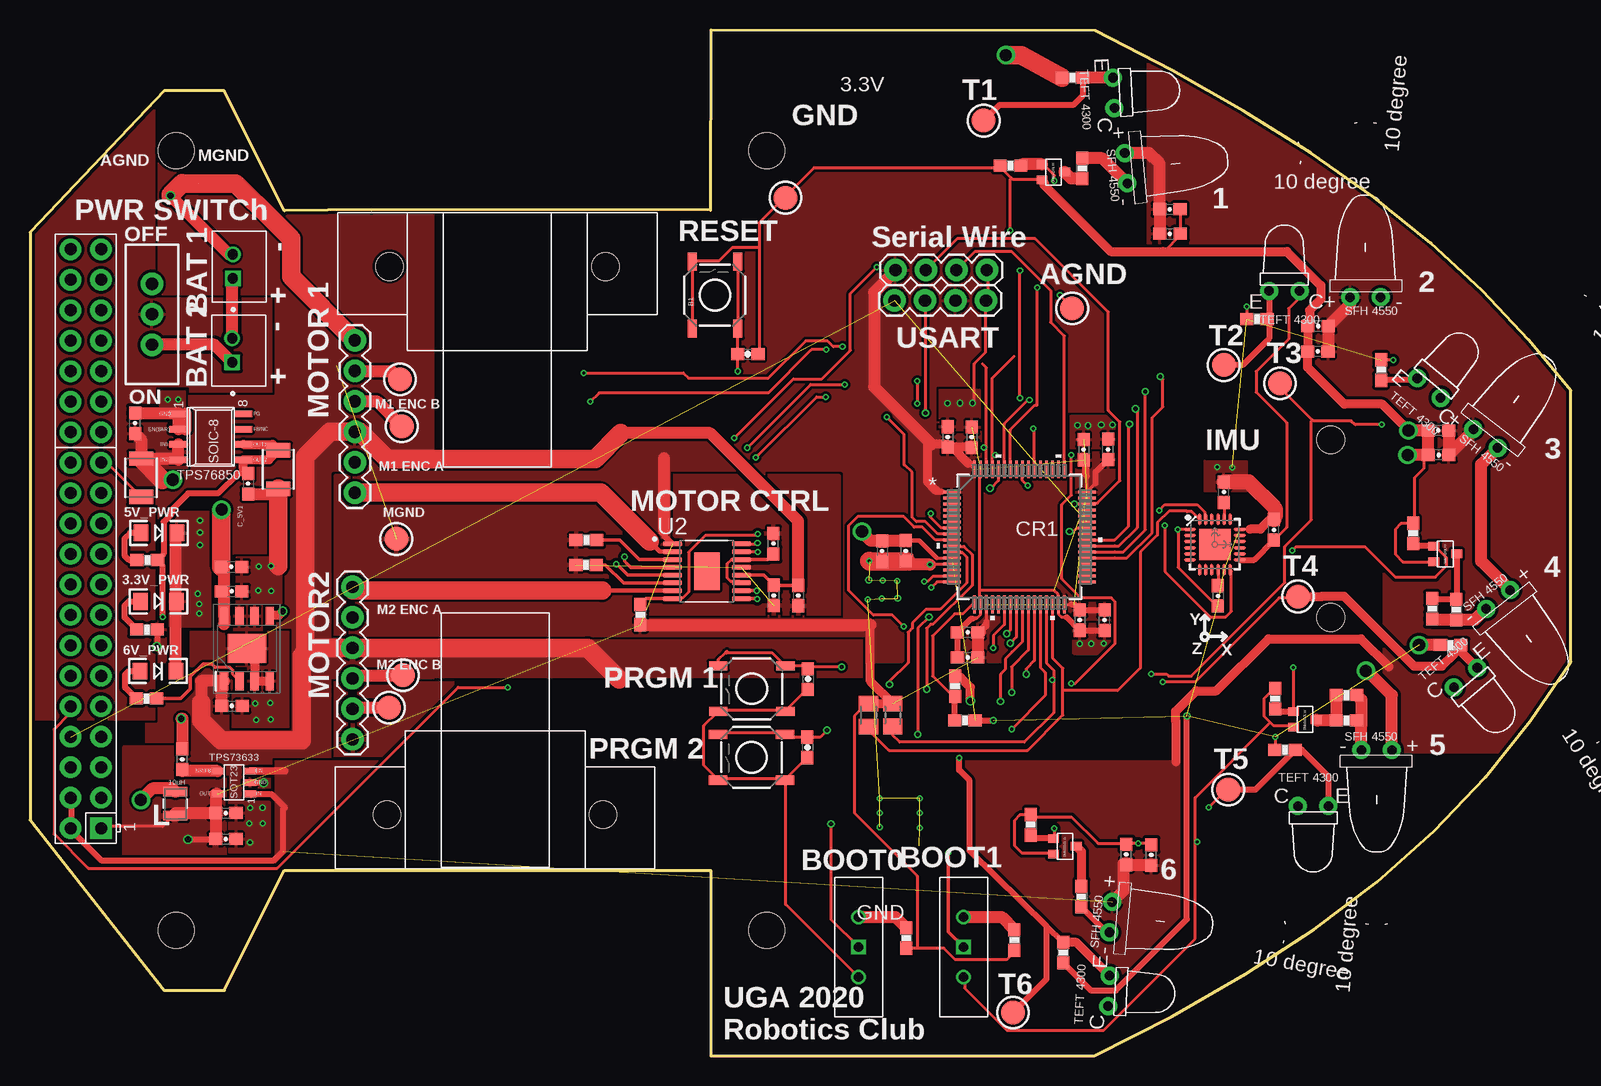
[diagram p5: board, top side]
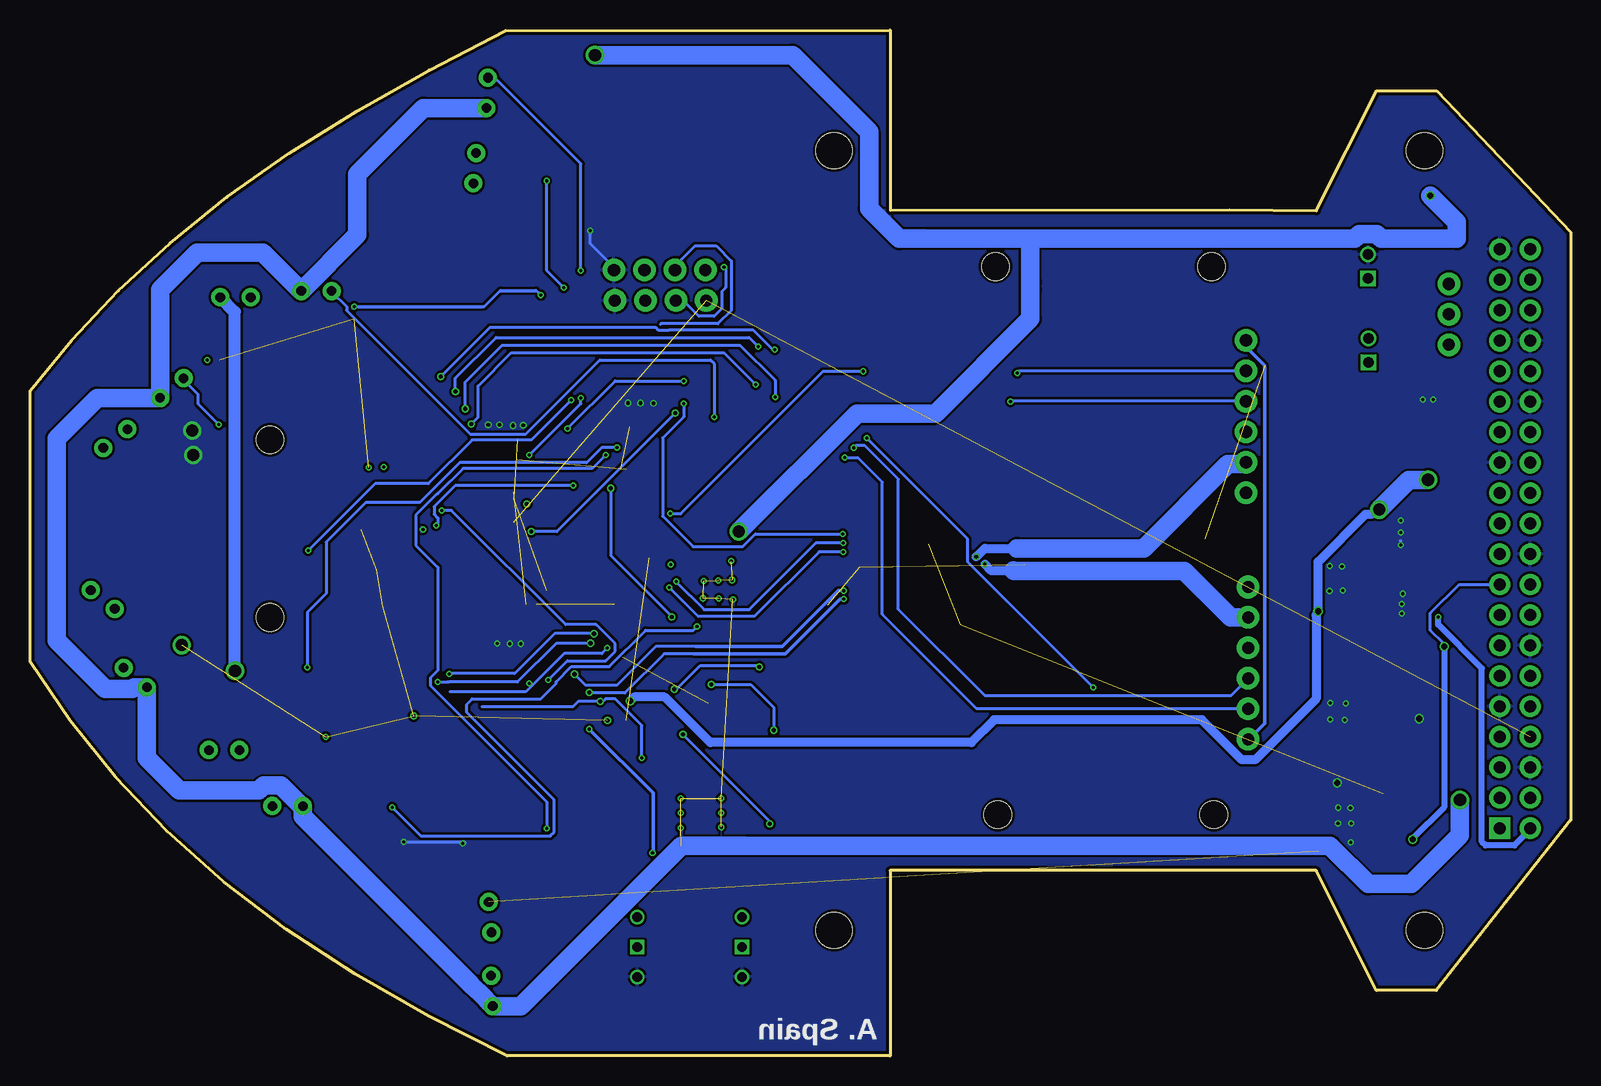
[diagram p6: board, bottom side, seen from below]

Size 128.4 x 85.52 mm. Coordinates in mm from the lower left corner, seen from the top.
Outline: 56.73,15.45 56.73,0 88.67,0 95.19,3.31 101.32,6.82 107.03,10.54 112.27,14.51 117.01,18.73 121.25,23.21 125.04,27.92 128.4,32.85 128.4,55.45 124.91,59.68 121.03,63.79 116.73,67.75 111.98,71.57 106.78,75.24 101.15,78.77 95.14,82.18 88.79,85.47 56.73,85.52 56.71,70.48 28.44,70.53 21.2,70.45 16.19,80.45 11.18,80.45 0,68.65 0,19.65 11.2,5.45 16.2,5.45 21.2,15.45 56.73,15.45
Copper layers (1*16): Top 0.018mm / dielectric 1.55mm / Bottom 0.018mm
Design rules "eC_2Layer_PClass6_BaseCopperO18_eCDefault *": minimum track width 8mil, minimum drill 10mil, track to track 8mil, track to pad 8mil, pad to pad 8mil, via to via 8mil, smd to smd 8mil, copper to edge 0.25mm, drill to drill 0.35mm, minimum pad ring 0.175mm, minimum via ring 0.125mm, stop-mask expansion 0mil, vias tented up to drill 0.45mm, thermal gap 0.2mm
Holes 3 mm at 12.2,10.45 12.2,75.45 61.4,10.45 61.4,75.45
Holes 2.3 mm at 108.4,36.55 108.4,51.35 29.75,20.1 47.75,20.1 47.95,65.8 29.95,65.8
tKeepout: area 34.3,15.9 to 43,36.9; area 34.5,49.3 to 43.2,70.3

### Footprints (pad centres in the part's own frame; a part is rotated, then mirrored left to right if it is on the bottom)
LED-1206 = smd 1.2 x 1.4: A -1.5,0; C 1.5,0
TACTILE-SWITCH-SMD = smd 1.524 x 0.762: 1 -2.794,1.905; 2 2.794,1.905; 3 -2.794,-1.905; 4 2.794,-1.905
0603-CAP = smd 1.1 x 1: 1 -0.85,0; 2 0.85,0
1210 = smd 1.2 x 2: 1 -1.6,0; 2 1.6,0
LQFP-64 = smd 1.473 x 0.229: 1 -5.626,3.75; 2 -5.626,3.25; 3 -5.626,2.75; 4 -5.626,2.25; 5 -5.626,1.75; 6 -5.626,1.25; 7 -5.626,0.75; 8 -5.626,0.25; 9 -5.626,-0.25; 10 -5.626,-0.75; 11 -5.626,-1.25; 12 -5.626,-1.75; 13 -5.626,-2.25; 14 -5.626,-2.75; 15 -5.626,-3.25; 16 -5.626,-3.75; 33 5.626,-3.75; 34 5.626,-3.25; 35 5.626,-2.75; 36 5.626,-2.25; 37 5.626,-1.75; 38 5.626,-1.25; 39 5.626,-0.75; 40 5.626,-0.25; 41 5.626,0.25; 42 5.626,0.75; 43 5.626,1.25; 44 5.626,1.75; 45 5.626,2.25; 46 5.626,2.75; 47 5.626,3.25; 48 5.626,3.75 | smd 0.229 x 1.473: 17 -3.75,-5.626; 18 -3.25,-5.626; 19 -2.75,-5.626; 20 -2.25,-5.626; 21 -1.75,-5.626; 22 -1.25,-5.626; 23 -0.75,-5.626; 24 -0.25,-5.626; 25 0.25,-5.626; 26 0.75,-5.626; 27 1.25,-5.626; 28 1.75,-5.626; 29 2.25,-5.626; 30 2.75,-5.626; 31 3.25,-5.626; 32 3.75,-5.626; 49 3.75,5.626; 50 3.25,5.626; 51 2.75,5.626; 52 2.25,5.626; 53 1.75,5.626; 54 1.25,5.626; 55 0.75,5.626; 56 0.25,5.626; 57 -0.25,5.626; 58 -0.75,5.626; 59 -1.25,5.626; 60 -1.75,5.626; 61 -2.25,5.626; 62 -2.75,5.626; 63 -3.25,5.626; 64 -3.75,5.626
1X04 = drill 1.016 pad 1.88: 1 0,0; 2 2.54,0; 3 5.08,0; 4 7.62,0
JST_B2B-PH-K-S(LF)(SN) = drill 0.86 square: 1 1,-0.55 | drill 0.86: 2 -1,-0.55
1007 = smd 2 x 0.8: 1 0,1; 2 0,-1
EMITTER = drill 0.8 pad 1.5: + -1.27,-0.5; - 1.27,-0.5
DMN3150LW = smd 0.7 x 0.9: D 0,0.95; G -0.65,-0.95; S 0.65,-0.95
M0805 = smd 1.3 x 1.6: 1 -0.95,0; 2 0.95,0
0603-RES = smd 1.1 x 1: 1 -0.85,0; 2 0.85,0
RECEIVER = drill 0.8 pad 1.5: C 1.27,-0.5; E -1.27,-0.5
SWITCH-SPDT = drill 1.016 pad 1.88: 1 0,2.54; 2 0,0; 3 0,-2.54
TESTPOINT_ROUND_2MM = smd 2 x 2: P$1 0,0
SOP65P640X120-17N = smd 1.57 x 0.41: 1 -2.87,2.275; 2 -2.87,1.625; 3 -2.87,0.975; 4 -2.87,0.325; 5 -2.87,-0.325; 6 -2.87,-0.975; 7 -2.87,-1.625; 8 -2.87,-2.275; 9 2.87,-2.275; 10 2.87,-1.625; 11 2.87,-0.975; 12 2.87,-0.325; 13 2.87,0.325; 14 2.87,0.975; 15 2.87,1.625; 16 2.87,2.275 | smd 2.105 x 3.115: 17 0,0
QFN-24-EP = smd 1.016 x 0.254: 1 -2.066,1.257; 2 -2.066,0.75; 3 -2.066,0.247; 4 -2.066,-0.287; 5 -2.066,-0.792; 6 -2.066,-1.297; 13 2.086,-1.297; 14 2.086,-0.792; 15 2.086,-0.287; 16 2.086,0.247; 17 2.086,0.75; 18 2.086,1.257 | smd 0.254 x 1.016: 7 -1.267,-2.122; 8 -0.762,-2.122; 9 -0.258,-2.122; 10 0.278,-2.122; 11 0.78,-2.122; 12 1.287,-2.122; 19 1.287,2.082; 20 0.78,2.082; 21 0.278,2.082; 22 -0.258,2.082; 23 -0.762,2.082; 24 -1.267,2.082 | smd 2.616 x 2.616: P$1 0.02,-0.01
TPS73633(SOT-23) = smd 0.55 x 1: EN 0.95,-1.35; GND 0,-1.35; IN -0.95,-1.35; NR/FB 0.95,1.35; OUT -0.95,1.35
TPS76850(SOIC-8) = smd 0.55 x 1.5: EN(BAR) -0.635,-2.7; FB/NC -0.635,2.7; GND -1.905,-2.7; IN1 0.635,-2.7; IN2 1.905,-2.7; OUT1 0.635,2.7; OUT2 1.905,2.7; PG -1.905,2.7
6P_HEADER = drill 1.016 pad 1.88: 1 0,0; 2 2.54,0; 3 5.08,0; 4 7.62,0; 5 10.16,0; 6 12.7,0
SPDT = drill 0.8: P$1 -2.5,0; P$3 2.5,0 | drill 0.8 square: P$2 0,0
SPLITTER = smd 0.102 x 0.102: 1 0,0; 2 0,0
SOIC127P600X100-9N = smd 1.525 x 0.7: 1 -2.712,1.905; 2 -2.712,0.635; 3 -2.712,-0.635; 4 -2.712,-1.905; 5 2.712,-1.905; 6 2.712,-0.635; 7 2.712,0.635; 8 2.712,1.905 | smd 2.4 x 3.2: 9 0,0
RASPI_GPIO_B+_PIN = drill 1 pad 1.778 square: 1 -24.13,-1.27 | drill 1 pad 1.778: 2 -24.13,1.27; 3 -21.59,-1.27; 4 -21.59,1.27; 5 -19.05,-1.27; 6 -19.05,1.27; 7 -16.51,-1.27; 8 -16.51,1.27; 9 -13.97,-1.27; 10 -13.97,1.27; 11 -11.43,-1.27; 12 -11.43,1.27; 13 -8.89,-1.27; 14 -8.89,1.27; 15 -6.35,-1.27; 16 -6.35,1.27; 17 -3.81,-1.27; 18 -3.81,1.27; 19 -1.27,-1.27; 20 -1.27,1.27; 21 1.27,-1.27; 22 1.27,1.27; 23 3.81,-1.27; 24 3.81,1.27; 25 6.35,-1.27; 26 6.35,1.27; 27 8.89,-1.27; 28 8.89,1.27; 29 11.43,-1.27; 30 11.43,1.27; 31 13.97,-1.27; 32 13.97,1.27; 33 16.51,-1.27; 34 16.51,1.27; 35 19.05,-1.27; 36 19.05,1.27; 37 21.59,-1.27; 38 21.59,1.27; 39 24.13,-1.27; 40 24.13,1.27

### Placement (x,y rotation side)
3.3V_PWR  10.71,37.89 0 top
5V_PWR  10.74,43.6 0 top
6V_PWR  10.66,32.07 0 top
B1  57.08,63.41 90 top
B2  60.16,30.6 180 top
B3  60.12,24.89 180 top
C1  72.98,42.1 270 top
C2  76.48,51.59 270 top
C4  78.48,51.57 270 top
C7  87.48,36.33 270 top
C8  71.01,42.07 270 top
C17  78.13,35.3 180 top
C18  78.14,33.21 0 top
C21  89.54,36.32 90 top
C22  89.85,50.56 90 top
C23  87.79,50.53 270 top
C_3.3V1  16.32,20.24 0 top
C_3.3V2  16.32,18.07 0 top
C_3.3V5  16.83,29.17 0 top
C_3.3V6  16.79,40.77 0 top
C_3.3V7  16.8,38.72 0 top
C_5V1  18.17,47.7 270 top
C_5V2  20.7,48.88 270 top
C_BAT1  8.75,52.73 90 top
C_BAT2  9.25,48.19 270 top
C_D  61.98,38.38 270 top
C_D1  64.02,38.37 270 top
C_D2  61.95,42.69 90 top
C_E_H1  107.33,60.83 180 top
C_E_H2  107.32,58.73 180 top
C_ELF1  95,68.52 0 top
C_ELF2  94.99,70.57 0 top
C_EM_D1  117.38,50.08 180 top
C_EM_D2  117.37,52.14 180 top
C_ERF1  91.36,16.79 90 top
C_ERF2  93.44,16.74 90 top
C_NR  12.69,24.72 90 top
C_NRST  59.82,58.5 0 top
C_NRST1  64.83,31.4 270 top
C_NRST2  64.79,25.71 270 top
CR1  82.45,43.26 0 top
IMU_C1  99,38.35 270 top
IMU_C2  103.66,43.85 90 top
IMU_C3  99.5,46.99 90 top
J1  79.74,65.51 180 top
J2  17.45,65.8 270 top
J3  17.4,58.8 270 top
J4  79.66,62.96 180 top
L1  12.12,21.02 180 top
LEFT_FRONT_EMITTER  91.83,74.05 275 top
NMOS1  85.28,73.67 270 top
NMOS2  117.94,41.84 270 top
NMOS3  86.24,17.47 270 top
NMOS4  106.24,28.04 270 top
R4  71.89,28.41 90 top
R5  69.87,28.4 90 top
R_B1  73.01,9.82 270 top
R_B2  82.04,9.64 270 top
R_ED1  116.84,37.27 270 top
R_ED2  118.86,37.19 270 top
R_ED_PD  115.25,43.55 270 top
R_EH1  109.7,27.95 0 top
R_EH2  109.71,30.06 0 top
R_EH_PD  103.75,29.77 270 top
R_ELF  87.68,73.98 90 top
R_ELF_PD  81.71,74.2 0 top
R_ERF  87.61,13.27 270 top
R_ERF_PD  83.41,19.25 270 top
R_PWR1  9.77,41.34 0 top
R_PWR3  9.7,29.78 0 top
R_PWR4  9.75,35.52 0 top
R_RLD  112.59,57.17 270 top
R_RLF  86.86,81.55 0 top
R_RLH  102.24,61.43 0 top
R_RRD  118.38,34.23 0 top
R_RRF  86.1,8.61 90 top
R_RRH  104.59,25.51 0 top
R_VM1  77.09,30.8 90 top
R_VM2  77.9,27.96 180 top
R_VM3  46.35,40.93 180 top
R_VM4  46.36,42.99 180 top
R_VM5  50.87,36.78 270 top
REC_LF  90.8,80.3 273 top
S2  10.16,61.82 0 top
T1  79.47,77.96 90 top
T2  99.49,57.59 90 top
T3  104.17,56.07 90 top
T4  105.67,38.29 90 top
T5  99.85,22.18 90 top
T6  81.93,3.61 90 top
TP7  30.98,52.47 0 top
TP8  30.83,56.41 0 top
TP9  31.08,31.72 0 top
TP10  29.91,29.03 0 top
TP11  30.52,43.09 0 top
TP12  86.85,62.3 90 top
TP13  62.96,71.54 90 top
U2  56.41,40.4 0 top
U6  98.73,42.64 0 top
U$3  16.99,22.78 90 top
U$4  15.07,51.6 270 top
U$5  26.88,39.09 270 top
U$6  27.07,46.94 90 top
U$7  116.9,56.05 320 top
U$8  119.95,31.15 220 top
U$9  90.4,5.38 267 top
U$11  121.6,51.85 322 top
U$13  90.56,11.52 265 top
U$14  69.05,9.07 270 top
U$15  77.79,9.07 270 top
U$16  14.05,72.72 0 top
U$17  122.65,37.65 218 top
U$18  111.28,63.75 0 top
U$19  112.22,24.99 180 top
U$20  106.94,20.33 180 top
U$21  104.53,64.26 0 top
U$22  11.66,71.73 0 top
U$23  18.08,33.95 90 top
X1  4.65,43.1 90 top

### Tracks (layer width: path | path; a pad name or v marks a point on that pad's centre or on a via)
3.3V  (via drill 0.51)  (6 unrouted)
  Top 0.254: CR1.1 75.99,47.01 | 79.7,36.31 CR1.19 79.7,36.18 | CR1.32 86.78,37.63 | 79.7,36.11 79.7,36.01 C17.1 | CR1.64 78.2,49.39 | 73.93,8.96 76.15,8.96 77.1,8.01 81.39,8.01 82.02,8.64 R_B2.2 | 73.93,8.96 73.13,8.96 R_B1.2 | 73.93,8.96 73.93,14.99 68.69,20.23 68.69,28.33 69.64,29.28 R5.2 | 52.83,43.57 52.81,43.57 52.83,43.78 | X1.1 5.98,19.12 11.06,19.12 11.7,19.76 L1.1 | C18.2 79.01,33.25 79.09,33.31
  Top 0.305: 88.81,47.75 CR1.48 88.07,48.32 | 87.94,49.53 C23.2
  Top 0.508: L1.1 11.88,19.78 | R_PWR4.2 10.6,34.29 10.61,34.28 10.61,34.18 v10.56,34.13 | v13.16,18.04 15.44,18.04 C_3.3V2.1 | 52.83,43.78 52.83,43.57 52.83,43.38 U2.1 | C21.2 89.54,37.18 C7.1 87.03,37.63 86.78,37.63 | 75.99,47.01 75.63,47.01 75.5,47.14 | 87.94,49.53 87.94,48.46 88.07,48.32 88.07,49.4 C23.2 | 88.81,47.75 88.81,48.67 C22.1 | C17.1 79.7,36.02 | 79.7,36.02 79.7,36.11 79.7,36.18 | 79.18,35.3 79.7,35.82 79.7,36.02
  Top 0.762: C4.2 78.45,50.74 C2.2 | C2.2 76.24,50.98 75.12,50.98 | 75.5,47.14 74.8,47.84 74.8,51.3 | 70.02,35.93 70.02,31.22 R4.2 71.88,29.35 R5.2 | C2.2 76.84,50.74 78.2,49.39
  Top 1.016: J1.4 72.12,65.44 70.34,63.67 70.34,55.76 74.8,51.3 75.12,50.98 | C_3.3V1.1 C_3.3V2.1 | L1.1 12.12,20.24 C_3.3V1.1 | U$3.OUT 15.47,21.83 C_3.3V1.1 | 52.83,49.8 52.83,43.78 | R_VM5.2 70.02,35.93 | 79.18,35.3 C17.1 C18.2
  Bottom 0.254: X1.17 5.98,39.28 9.31,39.28 11.7,36.9 11.7,35.47 10.58,34.36 v10.56,34.13
  Bottom 0.508: v10.56,34.13 10.56,20.72 13.2,18.07 v13.16,18.04
  pour Top (rank 3): 14.6,22.98 14.6,20.51 10.38,20.51 10.38,12.97 16.2,12.97 16.2,22.98
  pour Top (rank 3): 7.26,93.01 7.26,32.83 92.37,32.83 92.37,93.01
  pour Top: 7.92,25.67 16.15,25.67 16.15,2.33 7.92,2.33
5V  (via drill 0.25)  (1 unrouted)
  Top 0.508: 18.41,21.73 18.41,21.77 U$3.IN 20.11,21.83 21.23,20.72 | 21.23,20.72 21.25,20.69 | C_5V1.1 17.33,48.55 15.66,46.88 13.18,46.88 11.8,45.51 11.8,45.19 11.13,44.51 11.13,41.85 R_PWR1.2 10.74,41.19 11.06,40.87 v11.06,36.58 | X1.4 3.44,21.5 3.44,19.12 X1.2 3.44,18.8 5.98,16.26 20.27,16.26 21.06,17.06 21.06,20.55 21.23,20.72 | 95.52,28.65 95.52,24.52
  Top 0.635: U$3.EN 21.25,23.73
  Top 0.762: 20.11,50.48 C_5V2.1 | U$4.OUT1 20.21,50.97 C_5V2.1 | C_5V2.1 19.91,49.7 U$4.OUT2 17.77,48.95 C_5V1.1 | 95.52,24.52 95.52,27.91 95.48,27.95 95.48,28.72 97.18,30.42 98.87,30.42 103.21,34.77 110.91,34.77 113.25,32.42 113.23,32.42
  Top 1.016: C_EM_D2.1 118.23,52.13 C_EM_D1.1 120.29,52.14 U$11.+ | C_ERF2.1 93.44,15.94 C_ERF1.1 91.28,16.01 91.11,16.01 91.11,13.77 U$13.+ | U$18.+ 110.01,62.65 C_E_H1.1 108.18,58.74 C_E_H2.1 | LEFT_FRONT_EMITTER.+ 93.24,75.27 94.14,74.37 C_ELF2.1 C_ELF1.1
  Bottom 0.508: v11.06,36.58 11.06,35.95 7.41,32.3 7.41,17.85 7.09,17.53 4.71,17.53 3.28,18.96 X1.2
  pour Top: 20.49,24.55 20.49,-3.9 134.64,-3.9 134.64,24.55
  pour Top: 93.16,86.36 93.16,53.89 112.82,53.89 112.82,25.34 131.92,25.34 131.92,86.9
6V
  Top 0.305: U2.12 61.14,40.07 C_D.1 61.99,39.22 C_D1.1
  Top 0.762: 14.27,29.83 14.27,29.47
  Top 1.016: 14.27,29.83 14.27,31.24 U$23.1 15.98,31.24 C_3.3V5.1 | C_D1.1 64.02,44.57 56.69,51.91 49.24,51.91
  Top 1.524: 14.27,29.47 14.27,27.98 15.94,26.3 22.65,26.3 22.65,33.35 22.93,33.63 | 22.93,33.63 23.3,34.01 U$5.3 46.47,34.01 49.12,31.36 | 22.93,33.63 22.93,49.95 25,52.02 U$6.3 27.48,52.02 29.76,49.75 47.08,49.75 49.24,51.91
  pour Top (rank 4): 9.69,87.51 9.69,-3.9 33.6,-3.9 33.6,89.02 9.85,89.02
  pour Top: 25.19,34.48 74.39,34.48 74.39,31.71 25.16,31.71 25.16,34.48
6V_S
  Top 0.229: 13.39,30.61 13.39,31.6 14.44,32.65
  Top 0.254: U$23.2 16.9,31.78 16.9,32.16 16.68,32.38 15.43,32.38
  Top 0.305: R_PWR3.2 12.56,29.78 13.35,30.57 13.35,31.62 13.89,32.15 13.94,32.15 14.44,32.65 15.16,32.65 15.43,32.38
A3.3V  (via drill 0.25, 0.3, 1.02)  (13 unrouted)
  Top 0.254: CR1.13 76.77,40.96 v75,40.96 | IMU_C2.1 103.77,43.09 104.72,44.04 104.72,52.78 102.18,55.32 102.18,57.06 104.88,59.76 104.88,62.3 105.68,63.09 105.68,63.73 U$21.C
  Top 0.305: 73.23,41.01 73.13,41.1 C1.2 73.5,41.77
  Top 0.508: U6.13 102,41.34 IMU_C2.1
  Top 1.016: L1.2 11.85,22.29 10.2,22.29 v9.24,21.32 | v75,40.96 73.28,40.96 73.13,41.1
  Top 1.524: C1.2 72.95,41.22 C8.2 69.99,41.22 v69.94,41.26
  Bottom 1.524: v9.24,21.32 9.24,18.38 13.3,14.31 16.88,14.31 20.08,17.51 74.11,17.51 87.48,4.14 U$9.C 90.93,5.23 91.65,5.88 91.65,5.95 105.67,19.97 U$20.C 105.78,20.83 107.5,22.54 108.92,22.54 109.35,22.11 115.94,22.11 118.66,24.82 U$8.C 119.73,30.72 119.87,30.58 122.13,30.58 126.18,34.63 126.18,51.47 122.8,54.85 U$7.C 117.55,63.86 114.45,66.97 109,66.97 U$21.C 101.11,68.45 101.11,73.52 95.62,79.01 REC_LF.C
  other vias: 70.81,21.45 70.81,20.23 70.81,19.06 74.16,21.45 74.16,20.23 74.16,19.01 69.89,39.66 72.31,38.14 69.82,38.04 70.99,38.11 71.06,39.64 72.26,39.59
  pour Bottom (rank 3): 68.85,41.85 75.79,41.85 75.79,15.84 68.85,15.84
AGND  (via drill 0.25, 0.35, 0.51, 1.02)  (9 unrouted)
  Top 0.254: 75.55,41.51 CR1.12 | 101.64,43.89 101.39,43.89 | 101.39,43.89 U6.18 | U6.1 95.65,43.89 v95.65,43.88 95.68,43.73 95.68,40.71 98.85,37.54 IMU_C1.2 | 101.39,43.89 101.67,43.92 | v103.77,26.58 103.77,25.63 R_RRH.1 | 117.42,34.36 R_RRD.1 | v101.39,62.46 101.39,61.51 R_RLH.1 | v113.61,58.01 112.66,58.01 R_RLD.1 | v85.83,63.41 86.78,62.46 TP12.P$1
  Top 0.381: C1.1 74.11,42.95 75.55,41.51
  Top 0.508: R_VM2.1 v80.28,27.96 | v96.41,28.34 96.41,11.38 90.48,5.45 88.41,5.45 R_RRF.1
  Top 0.762: IMU_C2.2 103.27,44.65 102.53,43.92 101.67,43.92
  Top 1.016: v11.71,71.71 11.68,71.73 U$22.2 | 72.95,42.92 C1.1 71.04,42.95 C8.1 70.07,42.92 69.33,43.66 v69.33,43.71 | R_RRD.1 116.17,34.23 115.96,34.44 v115.75,34.24
  Top 1.27: IMU_C2.2 103.75,44.94 103.75,45.66 101.57,47.84 IMU_C3.2
  Top 1.524: R_RLF.1 82.59,83.43 v81.32,83.43 | v11.71,71.71 11.71,71.78 12.69,72.76
  Bottom 0.254: 45.03,64.52 45.03,63.87 | v101.39,62.46 90.53,62.46 89.2,63.79 86.21,63.79 v85.83,63.41
  Bottom 0.508: v80.28,27.96 v80.28,27.95
  Bottom 1.524: v81.32,83.43 64.84,83.43 58.47,77.05 58.47,70.63 55.95,68.11 45.03,68.11 | 45.03,68.11 18.01,68.11 17.61,68.51 16.19,68.51 15.79,68.11 9.49,68.11 9.49,69.49 v11.71,71.71 | 45.03,68.11 45.03,64.52 45.03,63.87 45.03,61.46 52.93,53.56 59.48,53.56 v69.33,43.71
  other vias: 98.93,49.09 100.17,49.06
  pour Bottom (rank 3): 130.4,85.18 130.4,24.78 78.15,24.78 78.15,29.02 95.09,29.02 95.09,58.21 53.84,58.21 53.84,85.18
  pour Top: 101.42,49.54 101.42,47.08 97.91,47.08 97.91,49.57
BOOT0  (via drill 0.35)
  Top 0.254: CR1.60 80.7,47.95 80.05,47.31 v80,47.31 | v74.92,36.59 73.98,35.65 v73.98,26.78 73.98,26.68 | v66.74,19.34 66.74,11.37 U$14.P$2
  Bottom 0.254: v80,47.31 80,41.69 74.97,36.67 74.97,36.62 74.95,36.59 v74.92,36.59 | v73.98,26.78 66.74,19.54 v66.74,19.34
BOOT1  (via drill 0.25)
  Top 0.254: 84.17,37.61 CR1.28 84.2,32.36 84.6,31.95 84.6,30.04 v81.79,27.23
  Top 0.305: v76.52,16.91 76.52,10.34 U$15.P$2
  Bottom 0.305: v81.79,27.23 76.47,21.91 76.47,16.96 v76.52,16.91
BRIDGE_A_1  (via drill 0.25)
  Top 0.254: U2.16 60.56,42.67 v60.62,42.74 | CR1.15 76.78,39.97 75.23,39.97 74.82,39.55 v74.53,39.55
  Bottom 0.254: v60.62,42.74 62.91,42.74 68.45,37.2 72.23,37.2 74.53,39.5
  Bottom 0.305: v74.53,39.55 74.53,39.5
BRIDGE_A_2  (via drill 0.25)
  Top 0.254: CR1.16 75.6,39.51 v75.12,39.03 | U2.15 60.64,42.02
  Top 0.305: v60.64,42.01 60.64,42.02
  Bottom 0.254: v60.64,42.01 62.65,42.01 68.03,36.63 72.72,36.63 v75.12,39.03
BRIDGE_B_1  (via drill 0.25, 0.35)
  Top 0.254: CR1.26 83.2,33.82 81.81,32.42 v81.81,30.3
  Top 0.305: 59.43,38.12 U2.9 60.59,38.12 | 60.6,38.11 60.59,38.12 | 60.59,38.12 60.59,38.08 v60.6,38.07
  Bottom 0.254: 73.07,33.52 75.56,33.52 78.78,30.3 | 78.78,30.3 78.84,30.24 | v81.81,30.3 78.78,30.3
  Bottom 0.305: v60.6,38.07 60.9,38.07 65.45,33.52 73.07,33.52
BRIDGE_B_2  (via drill 0.25, 0.35)
  Top 0.254: CR1.27 83.7,32.95 83,32.25 83,31.84 v83.03,31.81
  Top 0.305: 59.31,38.73 U2.10 v60.57,38.77
  Bottom 0.254: 72.92,34.13 76.24,34.13 79.44,30.93 82.14,30.93 v83.03,31.81
  Bottom 0.305: v60.57,38.77 61.06,38.77 65.7,34.13 72.92,34.13
D2_EM
  Top 1.016: U$17.- 120.41,36.34 R_ED2.2 116.92,36.34 R_ED1.2
D_EM
  Top 1.016: U$17.+ 120.92,41.24 120.92,49.31 U$11.-
EM_D  (via drill 0.25)
  Top 0.254: CR1.59 81.2,52.69 | 81.2,52.69 | 81.2,52.69 83.21,54.7 v83.29,54.68 | v105.2,42.14 105.52,42.46 111.23,42.46 113.77,39.92 117.11,39.92 118.06,40.87 118.06,41.51 117.26,42.3 117.11,42.3 NMOS2.G
  Top 0.508: NMOS2.G 115.46,42.49 R_ED_PD.2
  Bottom 0.254: v105.2,42.14 99.64,47.7 95.2,47.7 91.55,51.35 86.63,51.35 v83.29,54.68
EM_H  (via drill 0.25)
  Top 0.254: 79.39,57.67 79.7,57.37 79.7,50.71 | CR1.62 79.7,50.71 | v105.28,32.37 NMOS4.G | 79.7,50.71 v79.48,50.71
  Top 0.508: NMOS4.G 103.99,28.69 R_EH_PD.2
  Bottom 0.254: v105.28,32.37 105.28,36.98 103.72,38.54 103.72,42.82 100.41,46.13 95.92,46.13 92.61,49.44 82.02,49.44 80.75,50.71 v79.48,50.71
EM_LF  (via drill 0.25)
  Top 0.254: CR1.58 81.7,52.2 83.74,54.24 83.93,54.24 v83.93,64.05 | v85.36,72.94 85.36,73.41 84.72,74.05 NMOS1.G
  Top 1.016: NMOS1.G 82.69,74.32 R_ELF_PD.2
  Bottom 0.254: v85.36,72.94 85.36,65.48 v83.93,64.05
EM_RF  (via drill 0.25)
  Top 0.254: 82.01,58.33 80.2,56.52 80.2,50.08 | CR1.61 80.2,50.08 | v85.36,18.96 85.36,18.33 NMOS3.G | 80.2,50.08 v80.44,50.08
  Top 0.508: NMOS3.G 83.41,18.12 R_ERF_PD.2
  Bottom 0.254: v85.36,18.96 85.36,21.19 95.04,30.87 95.04,31.5 94.41,32.14 94.41,40.71 96.24,42.55 96.24,45.07 94.44,46.87 94.41,46.87 92.32,48.97 81.55,48.97 v80.44,50.08
GND  (via drill 0.25, 0.3, 0.51, 1.02)  (3 unrouted)
  Top 0.254: 78.99,36.56 79.2,36.76 CR1.18 79.16,37.69 79.16,38.81 | 86.39,36.57 85.95,36.57 85.7,36.82 CR1.31 85.67,37.69 85.67,38.49 85.36,38.81 79.16,38.81 | 78.54,36.56 78.99,36.56 | NMOS2.S 116.95,41.19 114.41,41.19 113.77,41.82 113.77,43.89 114.25,44.36 115.2,44.36 R_ED_PD.1 115.36,44.52 115.36,48.17 116.15,48.97 116.15,49.6 C_EM_D1.2 | 106.47,58.59 106.47,58.65 C_E_H2.2 106.47,58.81 106.47,60.71 C_E_H1.2 106.63,60.87 | 106.67,57.18 106.47,57.38 | C_ELF1.2 95.83,68.65 95.83,70.56 C_ELF2.2 | 81.78,73.18 80.91,74.05 R_ELF_PD.1 80.75,74.05 65.35,74.05 62.97,71.67 TP13.P$1 62.81,71.51 60.75,69.44 60.75,67.38 | 81.78,73.18 81.86,73.1 84.25,73.1 NMOS1.S | 95.83,68.49 C_ELF1.2 | B1.1 55.19,60.71 55.19,66.11 B1.2 55.19,66.27 57.42,66.27 58.53,67.38 60.75,67.38 | 60.75,67.38 60.75,58.65 C_NRST.2 | 106.76,62.28 106.63,62.14 | 107.58,64.23 107.58,64.36 104.88,67.06 94.51,67.06 | 94.41,67.06 94.51,67.06 | 79.16,38.81 79.16,48.81 CR1.63 | 78.54,36.44 78.69,36.42 78.85,36.42 79.01,36.58 78.99,36.56 | J1.1 79.8,65.48 79.8,63.09 J4.1 79.64,62.94 79.64,58.65 78.69,57.7 78.69,54.52 v78.56,54.42 | C_NRST1.2 64.72,30.55 62.97,28.81 B2.1 62.81,28.81 57.42,28.81 B2.2 57.26,28.65 56.15,27.54 56.15,24.2 57.26,23.09 B3.2 57.42,23.09 62.81,23.09 B3.1 | C_NRST2.2 64.72,24.84 62.97,23.09 B3.1 | C_ERF2.2 93.29,17.69 v92.34,17.69 91.39,17.69 C_ERF1.2 91.23,17.69 89.01,17.69 86.78,19.92 83.61,19.92 83.45,20.07 R_ERF_PD.1 83.29,20.07 82.5,20.07 82.02,19.6 82.02,17.53 82.66,16.9 85.2,16.9 NMOS3.S | 103.37,27.77 102.82,28.33 102.82,29.76 103.61,30.55 R_EH_PD.1 | 103.37,27.77 103.61,27.54 105.2,27.54 NMOS4.S
  Top 0.254: 103.37,27.77 97.1,21.5 97.1,17.85 | 97.1,17.85 97.1,9.76 89.48,2.13 81.39,2.13 77.89,5.63 77.89,6.42 U$15.P$3 | 97.1,17.85 v97.26,17.85 | B3.1 62.97,22.93 62.97,12.61 69,6.58 U$14.P$3 | v81.7,68.81 81.7,73.1 81.78,73.18 | C_ELF1.2 95.85,68.4 94.51,67.06 | X1.25 6.39,49.45 C_BAT2.2
  Top 0.305: C23.1 87.32,51.38 | 77.28,33.36 C18.1
  Top 0.508: U$3.GND 19.47,22.78 v19.47,22.75 | 86.39,36.57 C7.2 89.53,35.48 C21.1 | 78.54,36.44 78.42,36.44 C17.2 77.28,33.36
  Top 0.762: 18.71,32.75 U$23.3 U$23.4 | NMOS1.S 84.52,72.83 84.52,72.59 90.05,67.06 94.41,67.06 104.74,67.06 107.58,64.23 107.58,63.09 106.76,62.28 | 106.63,62.14 106.63,60.87 | C_E_H1.2 106.48,58.66 106.47,58.65 | v114.88,52.13 112.69,54.32 109.53,54.32 106.67,57.18 | 106.47,57.38 106.47,58.59
  Top 1.016: 12.65,72.72 U$22.1 16.59,66.8 J2.2 | C_BAT1.2 12.37,53.58 U$4.EN(BAR) | U$4.GND 12.95,53.51 12.95,52.21 | 6V_PWR.C 12.16,43.52 5V_PWR.C | v12.62,28.11 12.69,28.11 C_NR.2 | C_5V1.2 20.7,46.85 20.7,45.23 | v114.88,52.13 v114.88,52.14 C_EM_D2.2 116.53,52.14 C_EM_D1.2 v114.8,50.08
  Top 1.524: U$16.1 12.65,72.72 | C_5V2.2 20.7,45.23 20.7,40.83
  Bottom 0.254: v92.34,17.69 92.18,17.69 92.18,17.85 v97.26,17.85 | 14.24,42.93 14.17,42.93 | v81.7,68.81 81.7,67.7 79.64,65.64 J1.1
  other vias: 14.17,42.58 14.17,43.63 14.17,44.62 19.07,40.78 20.11,38.75 19.02,38.8 77.51,54.42 87.29,52.57 88.16,52.54 89.27,52.59 90.21,52.59 18.33,17.79 18.28,19.37 19.4,19.39 18.36,20.66 19.37,20.69 11.47,54.7 12.34,54.7 18.76,29.38 20.03,29.4 18.84,28 20.06,28.03 14.09,36.89 14.09,37.66 13.99,38.52 20.08,40.83 87.5,34.35 88.44,34.35 89.48,34.38 76.45,54.4
  pour Bottom: -3,91.25 135.7,91.25 135.7,-4.75 -3,-4.75
  pour Top: 11.25,45.12 14.52,45.12 14.52,42.18 11.25,42.18
  pour Top: 17.24,41.54 17.24,37.73 20.95,37.73 20.95,41.54
  pour Top: 17.06,37.61 19.3,37.61 19.3,35.32 21.51,35.32 21.51,27.42 16.88,27.42 16.88,30.16 18.18,30.16 18.18,32.5 13.38,32.5 13.38,35.35 17.04,35.35 17.04,37.63
  pour Top: 75.81,52.16 79.16,52.16 79.16,55.51 75.81,55.51
  pour Top: 86.71,53.33 91.08,53.33 91.08,50.69 86.71,50.69
  pour Top: 16.6,21.17 16.6,16.96 19.98,16.96 19.98,21.17
  pour Top: 12.9,55.36 12.9,53.2 10.84,53.2 10.84,55.39
  pour Top: 18.71,23.15 19.98,23.15 19.98,22.31 17.8,22.31 17.8,23.18 18.74,23.18
  pour Top: 11.65,38.9 11.65,35.83 15.03,35.83 15.03,45.3 12.36,45.3 12.36,38.9 11.7,38.9
  pour Top: 86.99,35.98 90.29,35.98 90.29,33.52 86.99,33.52
H2_EM
  Top 1.016: U$19.- 110.95,27.55 | 110.95,27.55 R_EH1.2 | R_EH2.2 110.95,29.67 110.95,27.55
H_EM  (via drill 1.02)
  Top 1.016: U$19.+ 113.49,30.05 111.45,32.09 v111.32,32.09
  Bottom 1.016: v111.32,32.09 111.32,62.02 U$18.-
I2C_SCL  (via drill 0.25)
  Top 0.254: R4.1 71.89,26.72 72.46,26.15 82.87,26.15 85.31,28.59 85.31,31.35 | CR1.29 84.7,32.76 85.31,32.15 85.31,31.35 | U6.23 97.92,44.77 97.92,45.29 97.9,45.32 97.26,45.95 94.56,45.95 v94.09,45.47 | v85.2,31.35 85.31,31.35
  Bottom 0.254: v94.09,45.47 93.29,45.47 83.77,35.95 81.23,35.95 79.64,34.36 79.64,33.73 80.44,32.93 83.61,32.93 v85.2,31.35
I2C_SDA
  Top 0.254: 69.87,27.16 71.57,25.46 83.13,25.46 86.07,28.41 86.07,30.44 | CR1.30 85.2,33.17 86.07,32.3 86.07,30.44 | U6.24 96.81,45.37 96.43,45.37 96.37,45.43 94.94,45.43 93.96,44.45 93.96,43.41 92.53,41.98 92.53,32.32 90.65,30.44 86.07,30.44
  Top 0.305: R5.1 69.87,27.16
INT  (via drill 0.25)
  Top 0.254: v94.56,44.2 94.56,40.39 98.37,36.58 99.64,36.58 100.12,37.06 100.12,40.39 U6.12 | v83.13,47.54 82.66,48.01 82.66,48.81 CR1.56
  Bottom 0.254: v94.56,44.2 94.41,44.36 94.41,44.84 94.72,45.16 94.72,45.79 92.98,47.54 v83.13,47.54
LF_EM
  Top 1.016: LEFT_FRONT_EMITTER.- 89.36,74.83 R_ELF.2
M1_A
  Top 0.305: 51.64,42.88 51.5,43.02
  Top 0.381: U2.2 52.5,42.02 51.64,42.88
  Top 0.508: 39.18,46.94 U$6.1
  Top 1.524: 51.64,42.88 47.58,46.94 U$6.1
M1_B  (via drill 0.3)
  Top 0.254: 49.83,40.96 49.57,41.21 49.57,41.59
  Top 0.305: U2.4 50.06,40.72 49.83,40.96 49.73,41.06 | 49.57,41.59 v49.55,41.59
  Bottom 0.254: 46.6,42.31 46.17,42.31
  Bottom 0.762: v49.55,41.59 48.84,42.31 46.6,42.31
  Bottom 1.524: U$6.2 27.22,49.33 28.58,49.33 35.6,42.31 46.17,42.31
M1_ENC_A  (via drill 0.25, 0.35)
  Top 0.254: CR1.37 90.39,41.51 | 90.39,41.51 90.4,41.5 | 90.39,41.51 91.41,41.51 93.5,43.6 93.5,53.2 94.4,54.1 94.4,56.4 v94.18,56.62 | v46.69,54.54 47.43,55.27 61.52,55.27 65.12,58.87 v66.34,58.87
  Top 1.016: U$6.4 28.89,54.56 TP7.P$1
  Bottom 0.254: 94.1,56.7 v94.18,56.62 90.06,60.75 76.26,60.75 76.03,60.52 75.14,60.52 75.12,60.54 68.17,60.54 66.49,58.87 v66.34,58.87 | U$6.4 46.59,54.56 46.65,54.5 v46.69,54.54
M1_ENC_B  (via drill 0.25, 0.35)
  Top 0.254: CR1.38 90.39,42.01 | 90.39,42.01 90.4,42 | 90.39,42.01 91.11,42.01 92.95,43.85 v92.95,55.37 | v46.14,56.94 54.44,56.94 54.89,56.48 61.52,56.48 64.63,59.6 66.47,59.6 66.95,59.12 v67.71,59.12
  Top 1.016: U$6.5 30.13,57.1 TP8.P$1
  Bottom 0.254: v92.95,55.37 92.95,56.49 89.55,59.88 68.47,59.88 v67.71,59.12 | U$6.5 45.98,57.1 v46.14,56.94
M2_A
  Top 0.381: U2.7 47.67,38.77
  Top 1.524: 47.67,38.77 26.88,38.77 U$5.1
M2_B  (via drill 0.25)
  Top 0.305: U2.5 49.82,40.07 48.92,40.98 v48.84,40.98
  Bottom 0.762: 46.4,40.43 48.28,40.43 v48.84,40.98
  Bottom 1.524: U$5.2 28.35,36.55 32.23,40.43 46.4,40.43 46.45,40.48
M2_ENC_A  (via drill 0.25, 0.35)
  Top 0.254: CR1.40 90.39,43.01 | 90.39,43.01 90.4,43 | 90.39,43.01 91.55,44.17 91.55,52.67 v91.62,52.67 | v59.76,50.69 65.04,55.97 67.89,55.97 v67.91,55.94
  Top 1.016: U$5.4 27.14,31.72 TP9.P$1
  Bottom 0.254: v91.62,52.67 91.05,53.24 91.05,55.84 88.28,58.61 70.58,58.61 v67.91,55.94 | U$5.4 28.34,30.01 48.81,30.01 56.03,37.23 56.03,48.07 58.84,50.89 59.56,50.89 v59.76,50.69
M2_ENC_B  (via drill 0.25, 0.35)
  Top 0.254: CR1.39 90.39,42.51 | 90.39,42.51 90.74,42.51 92.25,44.02 92.25,53.94 v92.12,53.94 | 90.39,42.51 90.4,42.5 | v60.5,49.87 65.55,54.93 v66.31,54.93
  Top 1.016: U$5.5 26.99,29.03 TP10.P$1
  Bottom 0.254: 92.07,53.89 v92.12,53.94 92.12,56.18 89.05,59.25 69.23,59.25 66.31,56.33 v66.31,54.93 | U$5.5 47.85,28.93 | 47.85,28.93 47.87,28.94 | 47.85,28.93 49.5,28.93 57.37,36.79 57.37,47.82 59.38,49.82 60.47,49.82 60.5,49.85 v60.5,49.87
MGND  (3 unrouted)
  Top 0.305: U2.13 59.26,40.7
  Top 1.016: U$16.2 17.2,72.72 17.55,72.38 17.55,72.34 20.38,69.5
  Top 1.524: U$16.2 17.16,72.72 20.38,69.5 21.77,68.11 21.77,64.94 U$6.6
  Bottom 0.305: U$6.6 26.94,59.6 26.94,58.97 25.51,57.54 25.51,27.69 26.78,26.42 U$5.6
  pour Top (rank 2): 25.49,48.25 25.49,24.8 56.2,24.8 56.2,34.48 67.38,34.48 67.38,48.32 25.47,48.32
N$1
  Top 0.508: R_PWR4.1 7.89,36.53 7.89,37.53 8.25,37.89 3.3V_PWR.A
N$2
  Top 0.305: 53.53,41.36 U2.3 50.76,41.37 49.14,42.99 R_VM4.1
N$3
  Top 1.016: J3.2 16.85,64.75 J2.1
N$4
  Top 1.016: U$15.P$1 80.97,11.57 R_B2.1
N$5
  Top 0.762: NMOS3.D 87.61,17.04 R_ERF.1
N$6
  Top 1.016: U$14.P$1 72.12,11.57 R_B1.1
N$7
  Top 1.016: R_ELF.1 86.77,73.13 NMOS1.D
N$8
  Top 0.305: 53.47,39.48 U2.6 49.46,39.42 47.95,40.93 R_VM3.1
N$9
  Top 0.254: 7.93,31.75 7.96,31.78
  Top 0.508: R_PWR3.1 7.93,30.69 7.93,31.75 | 7.96,31.78 8.25,32.07 6V_PWR.A
N$11
  Top 0.254: U2.14 59.24,41.41 59.21,41.39 58.47,41.39 58.11,41.03 58.11,39.84 58.41,39.54 59.16,39.54 U2.11
  Top 0.305: U2.14 61.49,41.37 C_D2.1
N$14
  Top 0.508: 5V_PWR.A 8.35,43.6 7.87,43.12 7.87,41.72 8.25,41.34 R_PWR1.1
N$18
  Top 0.508: NMOS2.D 118.89,38.07 R_ED2.1 116.92,38.04 R_ED1.1
N$19
  Top 1.016: NMOS4.D 107.28,27.95 R_EH1.1 R_EH2.1
N$26
  Top 1.016: U$3.NR/FB 12.69,23.73 C_NR.1
N$28
  Top 0.254: U6.10 IMU_C1.1
N$29
  Top 0.254: IMU_C3.1 99.51,46.13 U6.20
NFAULT  (via drill 0.25)
  Top 0.254: CR1.54 83.7,52.25 v83.61,52.3 | v60.66,43.51 60.66,43.36 56.25,43.36 54.88,41.98 54.88,38.65 54.4,38.17 53.61,38.17 U2.8 | v73.93,56.27 v73.93,54.36
  Top 0.305: U2.8 51.37,38.12 R_VM5.1
  Bottom 0.254: v60.66,43.51 67.95,43.51 69,42.46 73.13,42.46 75.67,45 75.67,51.51 73.93,53.25 v73.93,54.36 | v73.93,56.27 79.64,56.27 v83.61,52.3
PRGM_1  (via drill 0.35)
  Top 0.254: B2.4 57.36,33.03 57.98,33.64 | 57.98,33.64 58.08,33.75 | CR1.10 76.87,42.47 77.83,42.47 78.5,41.79 78.5,39.23 75.24,35.96 75.05,35.96 74.72,35.63 v74.72,30.57 | v67.63,32.42 65,32.42 C_NRST1.1 64.57,32.51 B2.3 62.81,32.61 61.86,33.57 58.05,33.57 57.98,33.64
  Bottom 0.254: v74.72,30.57 74.49,30.57 72.54,32.53 67.73,32.53 v67.63,32.42
PRGM_2  (via drill 0.35)
  Top 0.254: CR1.11 76.87,41.97 77.68,41.97 78.05,41.6 78.05,39.42 75.85,37.22 74.66,37.22 73.53,36.08 73.53,35.65 73.17,35.29 73.17,32.75 71.62,31.21 v71.62,30.95 | v66.41,27.14 65.84,26.56 C_NRST2.1 63.15,26.56 B3.3 62.81,26.9 57.42,26.9 B3.4
  Bottom 0.254: v71.62,30.95 68.34,30.95 66.44,29.05 66.44,27.14 v66.41,27.14
REC_LD  (via drill 0.25, 0.35)
  Top 0.254: CR1.23 81.7,35.49 v81.4,35.19 | 106.87,53.01 106.95,52.94 110.12,52.94 110.44,52.62 v112.66,52.62 | 106.87,53.01 104.25,55.63 104.25,55.95 T3.P$1 | v93.45,31.82 94.72,31.82 94.88,31.66 96.79,31.66 104.56,39.44 104.56,42.46 106.79,44.68 106.79,52.94 106.87,53.01
  Top 0.508: U$7.E 115.44,56.32 R_RLD.2
  Bottom 0.254: v81.4,35.19 84.68,35.19 88,31.87 93.45,31.87 | 93.45,31.87 93.47,31.87 | v112.66,52.62 114.41,54.36 114.41,55.16 115.68,56.43 U$7.E | v93.45,31.82 93.45,31.87
REC_LF  (via drill 0.25)
  Top 0.254: CR1.22 81.2,35.96 80.28,35.04 v80.28,34 | 87.9,81.55 87.9,81.67 R_RLF.2 | v82.5,54.84 v82.5,65.48 | v86.78,50.08 86.78,46.74 85.99,45.95 85.99,39.76 87.58,38.17 90.12,38.17 90.44,37.85 90.44,34.36 87.1,31.03 v86.78,31.03
  Top 0.508: T1.P$1 80.78,79.27 86.92,79.27 87.71,80.06 R_RLF.2
  Top 1.016: REC_LF.E 87.9,81.55 R_RLF.2
  Bottom 0.254: v80.28,34 80.74,33.54 83.89,33.54 86.59,30.84 | 93.41,30.34 87.09,30.34 86.59,30.84 | v82.5,65.48 82.5,74.37 89.64,81.51 90.12,81.51 REC_LF.E | v82.5,54.84 82.5,54.36 v86.78,50.08 | 86.59,30.84 v86.78,31.03
REC_LH  (via drill 0.25)
  Top 0.254: CR1.8 75.65,43.51 74.62,44.54 73.86,44.54 73.5,44.9 73.5,48.66 72.89,49.26 | 72.89,49.26 72.84,49.26 | v71.39,53.25 72.81,51.82 72.81,49.28 72.89,49.26
  Top 0.508: U$21.E 103.26,61.6 R_RLH.2 103.26,61.26 103.26,59.81 101.05,57.59 T2.P$1
  Bottom 0.254: v71.39,53.25 71.39,57.7 71.7,58.01 80.91,58.01 87.1,51.82 91.71,51.82 102.03,62.14 102.03,62.46 103.29,63.73 U$21.E
REC_RD  (via drill 0.25, 0.35)
  Top 0.254: CR1.24 82.2,34.9 v81.69,34.39 | v94.41,31.19 97.1,31.19 104.09,38.17 105.36,38.17 T4.P$1
  Top 0.762: U$8.E 119.23,33.72 R_RRD.2 118.67,33.67 118.67,33.49 117.67,32.49 115.33,32.49 109.48,38.33 107.66,38.33 107.62,38.29 T4.P$1
  Bottom 0.254: v81.69,34.39 84.54,34.39 87.78,31.15 93.49,31.15 93.61,31.19 v94.41,31.19
REC_RF  (via drill 0.25, 0.35)
  Top 0.254: CR1.25 82.7,34.5 81.86,33.67 | 81.86,33.67 81.83,33.67 | 81.86,33.67 81.27,33.08 81.27,32.22 80.92,31.87 80.91,31.82 80.87,31.76 v80.87,29.55
  Top 0.508: R_RRF.2 84.72,10.81 | 84.72,10.81 78.3,17.1 78.3,22.95 77.42,23.83 v77.42,24.84 | U$9.E 87.98,8.67 | T6.P$1 84.72,6.41 84.72,10.81
  Top 0.762: U$9.E 87.19,9.46 R_RRF.2
  Bottom 0.254: 90.75,29.1 83.15,29.1 82.7,29.55 v80.87,29.55 80.75,29.6 80.59,29.6 80.44,29.76 79.64,29.76 77.42,27.54 v77.42,24.84
REC_RH  (via drill 0.25)
  Top 0.254: CR1.9 75.44,43.01 74.36,44.08 73.67,44.08 72.75,45 69,45 68.21,44.2 68.21,38.81 70.28,36.74 71.86,36.74 v72.81,35.79 | v98.22,20.71 99.64,22.14 T5.P$1
  Top 0.508: U$20.E 108.21,23.3 105.99,25.51 R_RRH.2 102.11,22.18 T5.P$1
  Bottom 0.254: v72.81,35.79 73.13,35.47 77.1,35.47 80.12,32.46 83.29,32.46 84.56,31.19 84.56,31.03 85.83,29.76 91.55,29.76 92.02,29.28 92.02,28.65 84.72,21.34 84.72,18.64 85.04,18.33 95.83,18.33 v98.22,20.71
RESET  (via drill 0.25)
  Top 0.254: B1.3 59.09,60.52 | C_NRST.1 58.81,58.34 | C_NRST.1 58.88,58.42 | CR1.7 75.93,44.01 75.02,44.92 75.05,44.95 v75.05,45.2 | v58.97,57.06 C_NRST.1 | C_NRST.1 58.98,58.52 B1.3 | B1.4 B1.3
  Bottom 0.254: v75.05,45.2 74.16,45.2 62.3,57.06 v58.97,57.06
RF_EM
  Top 0.508: R_ERF.2 89.74,10.3 U$13.-
SWCLK
  Top 0.254: J1.2 78.76,67.07 81.78,67.07 85.06,63.79 85.06,61.15 86.2,60.01 CR1.49
SWDIO  (via drill 0.35)
  Top 0.254: 87.07,46.01 CR1.46 88.13,46.07 88.95,46.07 90.82,47.94 90.82,52.84 89.86,53.81 89.86,62.02 83.76,68.11 77.26,68.11 J1.3 | 87.07,46.01 87.06,46.01 | 87.07,46.01 v87.01,46.01
  Bottom 0.254: 75.86,61 75.83,61.03 71.07,61.03 69.96,62.14 69.96,66.27 71.23,67.54 72.97,67.54 74.56,65.95 74.56,65.64 J1.3
USART1_RX  (2 unrouted)
USART1_TX  (via drill 0.25, 0.35)
  Top 0.254: CR1.42 88.02,43.95 87.2,43.95 86.95,43.7 86.78,43.7 | 86.78,43.7 v86.63,43.7 | J4.3 74.58,53.84 74.62,53.8 v74.62,53.58 | 86.78,43.7 86.78,43.73 v86.63,43.7 | v70.57,65.75 68.37,63.55 68.37,58.81 65.99,56.43 63.61,56.43 v58.69,51.51 | v39.8,30.71 35.67,30.71 20.59,15.63 4.87,15.63 2.01,18.49 2.01,27.22 3.28,28.49 3.28,29.12 X1.10
  Bottom 0.254: v74.62,53.58 84.5,43.7 v86.63,43.7 | v70.57,65.75 70.43,65.62 70.43,64.05 70.75,63.73 70.75,62.3 71.39,61.67 72.66,61.67 73.93,62.94 74.56,62.94 J4.3 | v58.69,51.51 50.27,43.09 50.27,41.19 v39.8,30.71
V_BATT  (via drill 0.51, 1.02)
  Top 0.762: C_3.3V7.1 15.98,38.81 16.17,38.81 | v21.06,37.06 20.74,36.74 20.11,36.74 U$23.5 | v78.37,29.6 78.37,30.71 77.58,31.5 77.1,31.5 R_VM1.2
  Top 1.016: C_3.3V6.1 16.17,40.77 16.17,38.81 U$23.8 16.17,35.97 | C_BAT1.1 9.25,51.38 C_BAT2.1 12.28,49.79 U$4.IN2 U$4.IN1 | 15.94,45.43 15.97,45.43 v15.97,45.53 | v11.91,48.02 11.03,48.02
  Top 1.524: C_3.3V6.1 15.94,45.43 | 11.03,48.02 C_BAT2.1
  Bottom 0.762: v15.97,45.53 16.62,45.16 17.09,45.16 21.06,41.19 v21.06,37.06 21.22,36.74 21.22,29.76 26.3,24.68 27.41,24.68 30.75,28.01 48.05,28.01 49.95,26.11 71.7,26.11 75.51,29.92 78.05,29.92 v78.37,29.6
  Bottom 1.016: 11.93,47.99 v11.91,48.02
  Bottom 1.524: v15.97,45.53 13.51,47.99 11.93,47.99
  pour Top (rank 2): 20.08,63.11 20.08,55.36 13.12,55.36 13.12,49.01 7.26,49.01 7.26,63.13
  pour Top: -0.74,88.33 -0.74,28.08 10.36,28.08 10.36,88.33
VBAT_POWER
  Top 1.016: J3.1 15.37,59.28 S2.3
VBAT_SENSE
  Top 0.254: R_VM1.1 76.94,29.95 75.23,31.66 75.23,35.02 77.06,36.84 77.74,36.84 78.53,37.63 CR1.17
  Top 0.508: R_VM2.2 77.05,29.91 R_VM1.1

### Text on the board
tPlace: 3.3V | GND | UGA 2020 / Robotics Club
tNames: GND | MGND | AGND | 1 | PWR SWITCh | OFF | BAT 1 | RESET | Serial Wire | - | AGND | 2 | + | - | USART | ON | BAT 2 | + | M1 ENC B | MOTOR 1 | IMU | 3 | M1 ENC A | MOTOR CTRL | MGND | 4 | M2 ENC A | Y | Z | X | M2 ENC B | PRGM 1 | MOTOR2 | PRGM 2 | 5 | L | BOOT1 | BOOT0 | 6
bNames: A. Spain
Document: Notes / ----------------------- / Bottom layer - GND / Add net classes / Add power planes / Use vector font
tDocu: Bottom Planes / ------------ / 1. AGND / 2. GND / 3. A3.3V | Top Planes / --------- / 1. 5V, GND / 2.MGND / 3.3.3V / 4. 6V / 5. / 6. V_BATT